# EAGLE design CC3200 (EAGLE 9.6.2)
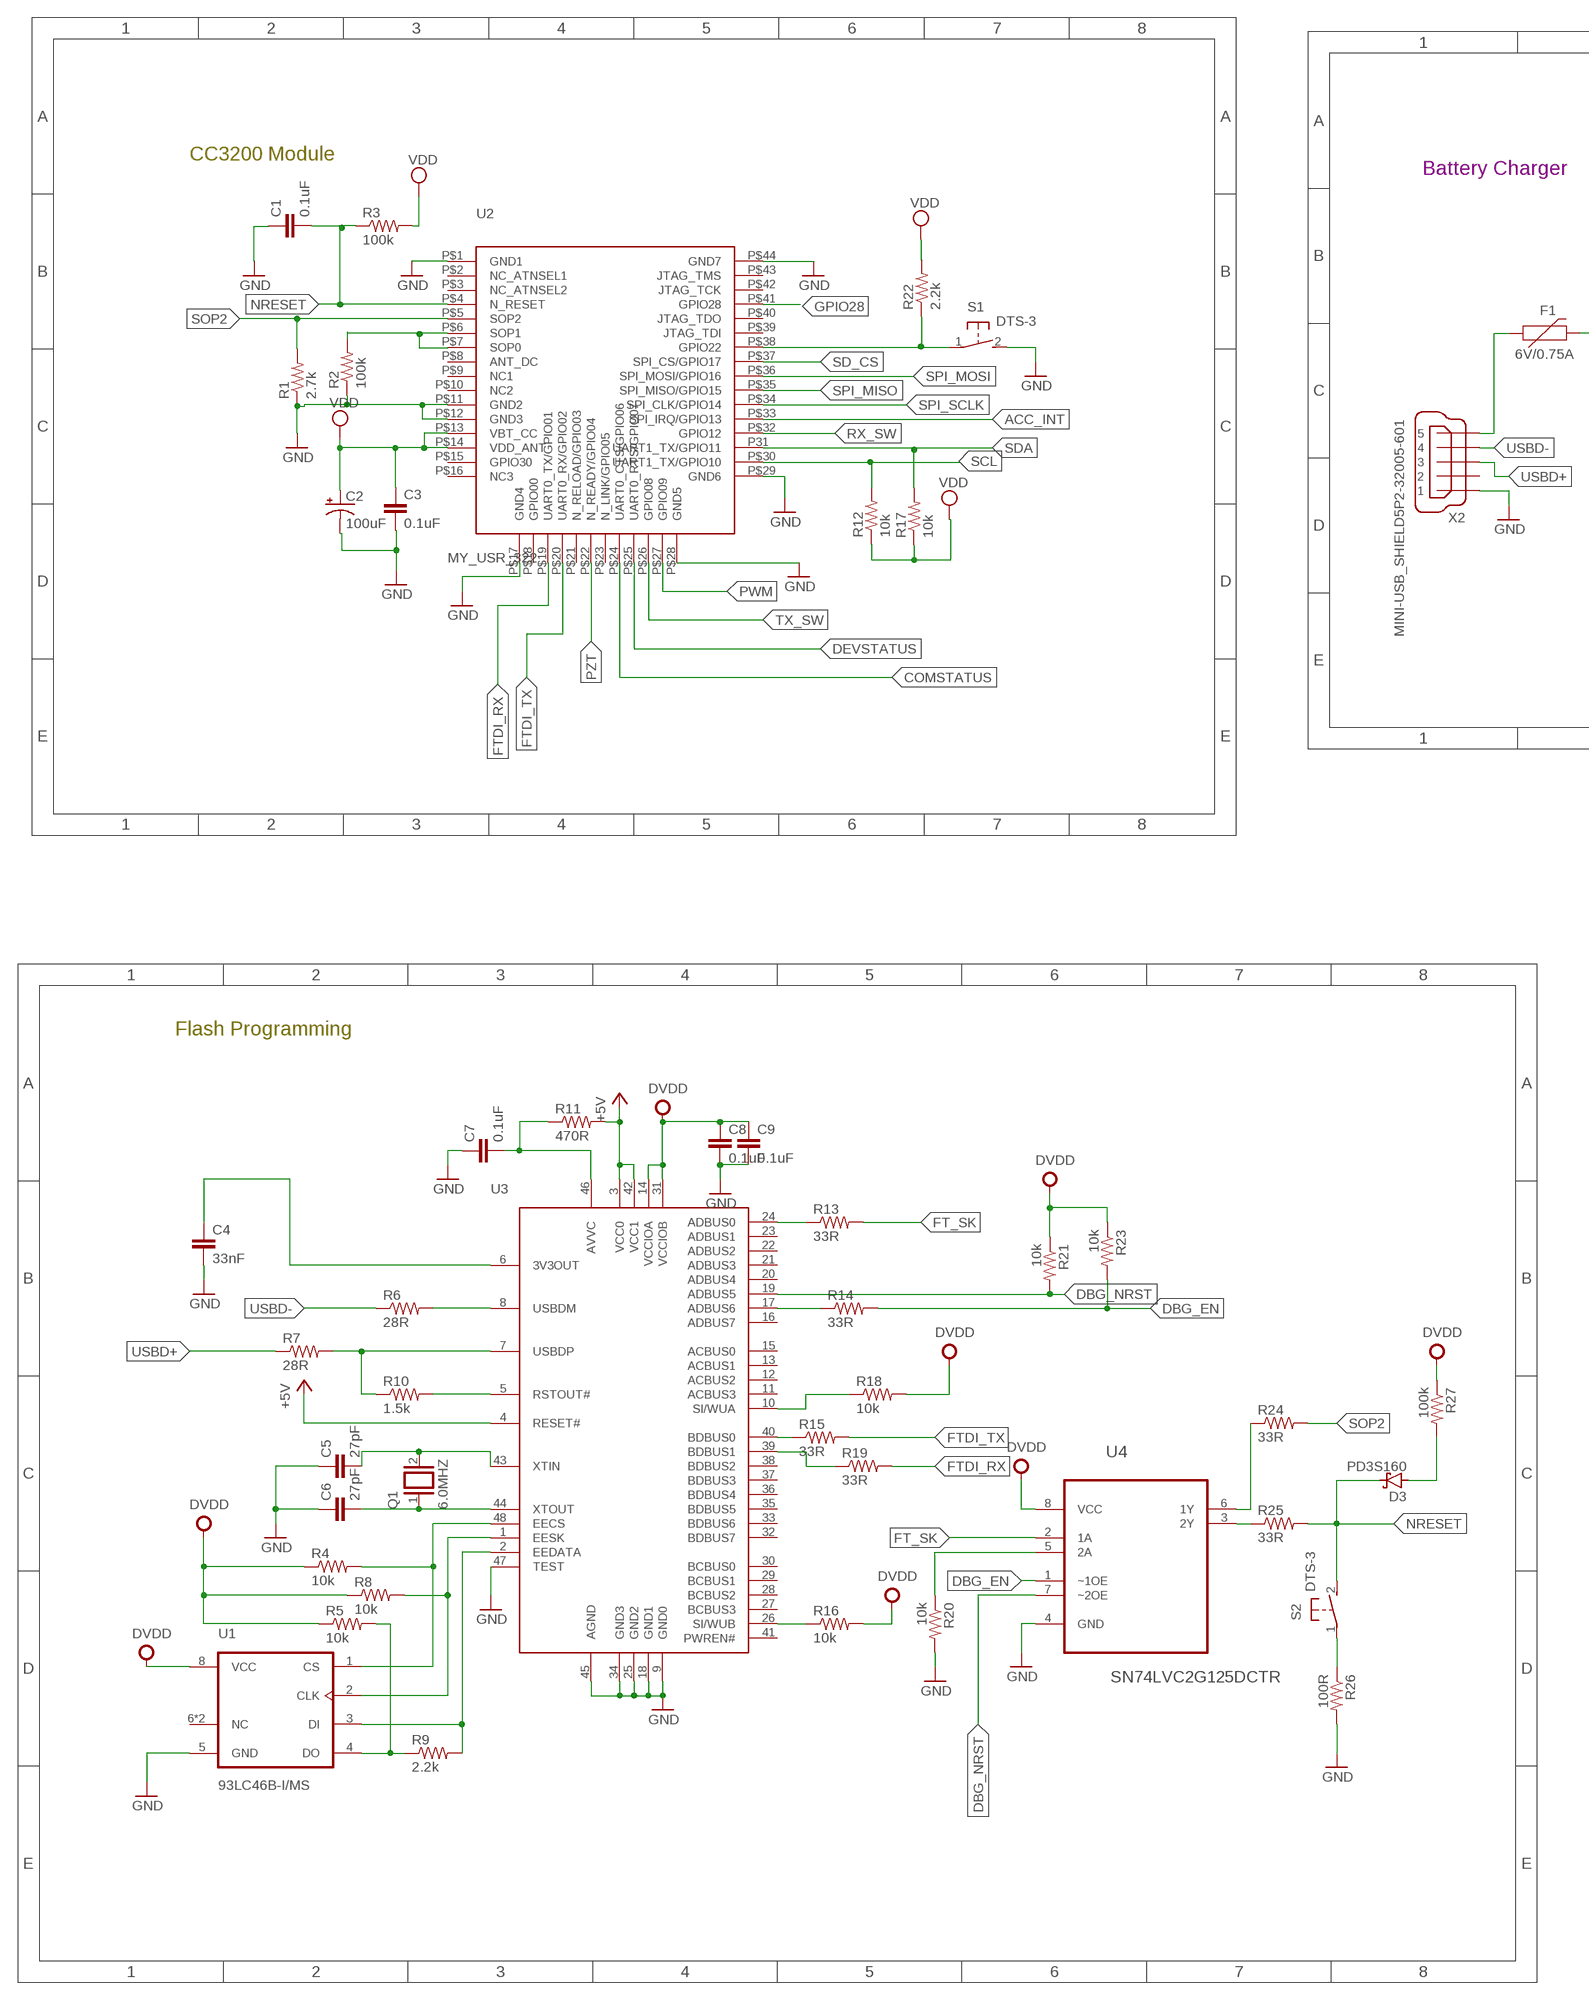
[diagram p0: schematic, sheet 1, part 1 of 2]
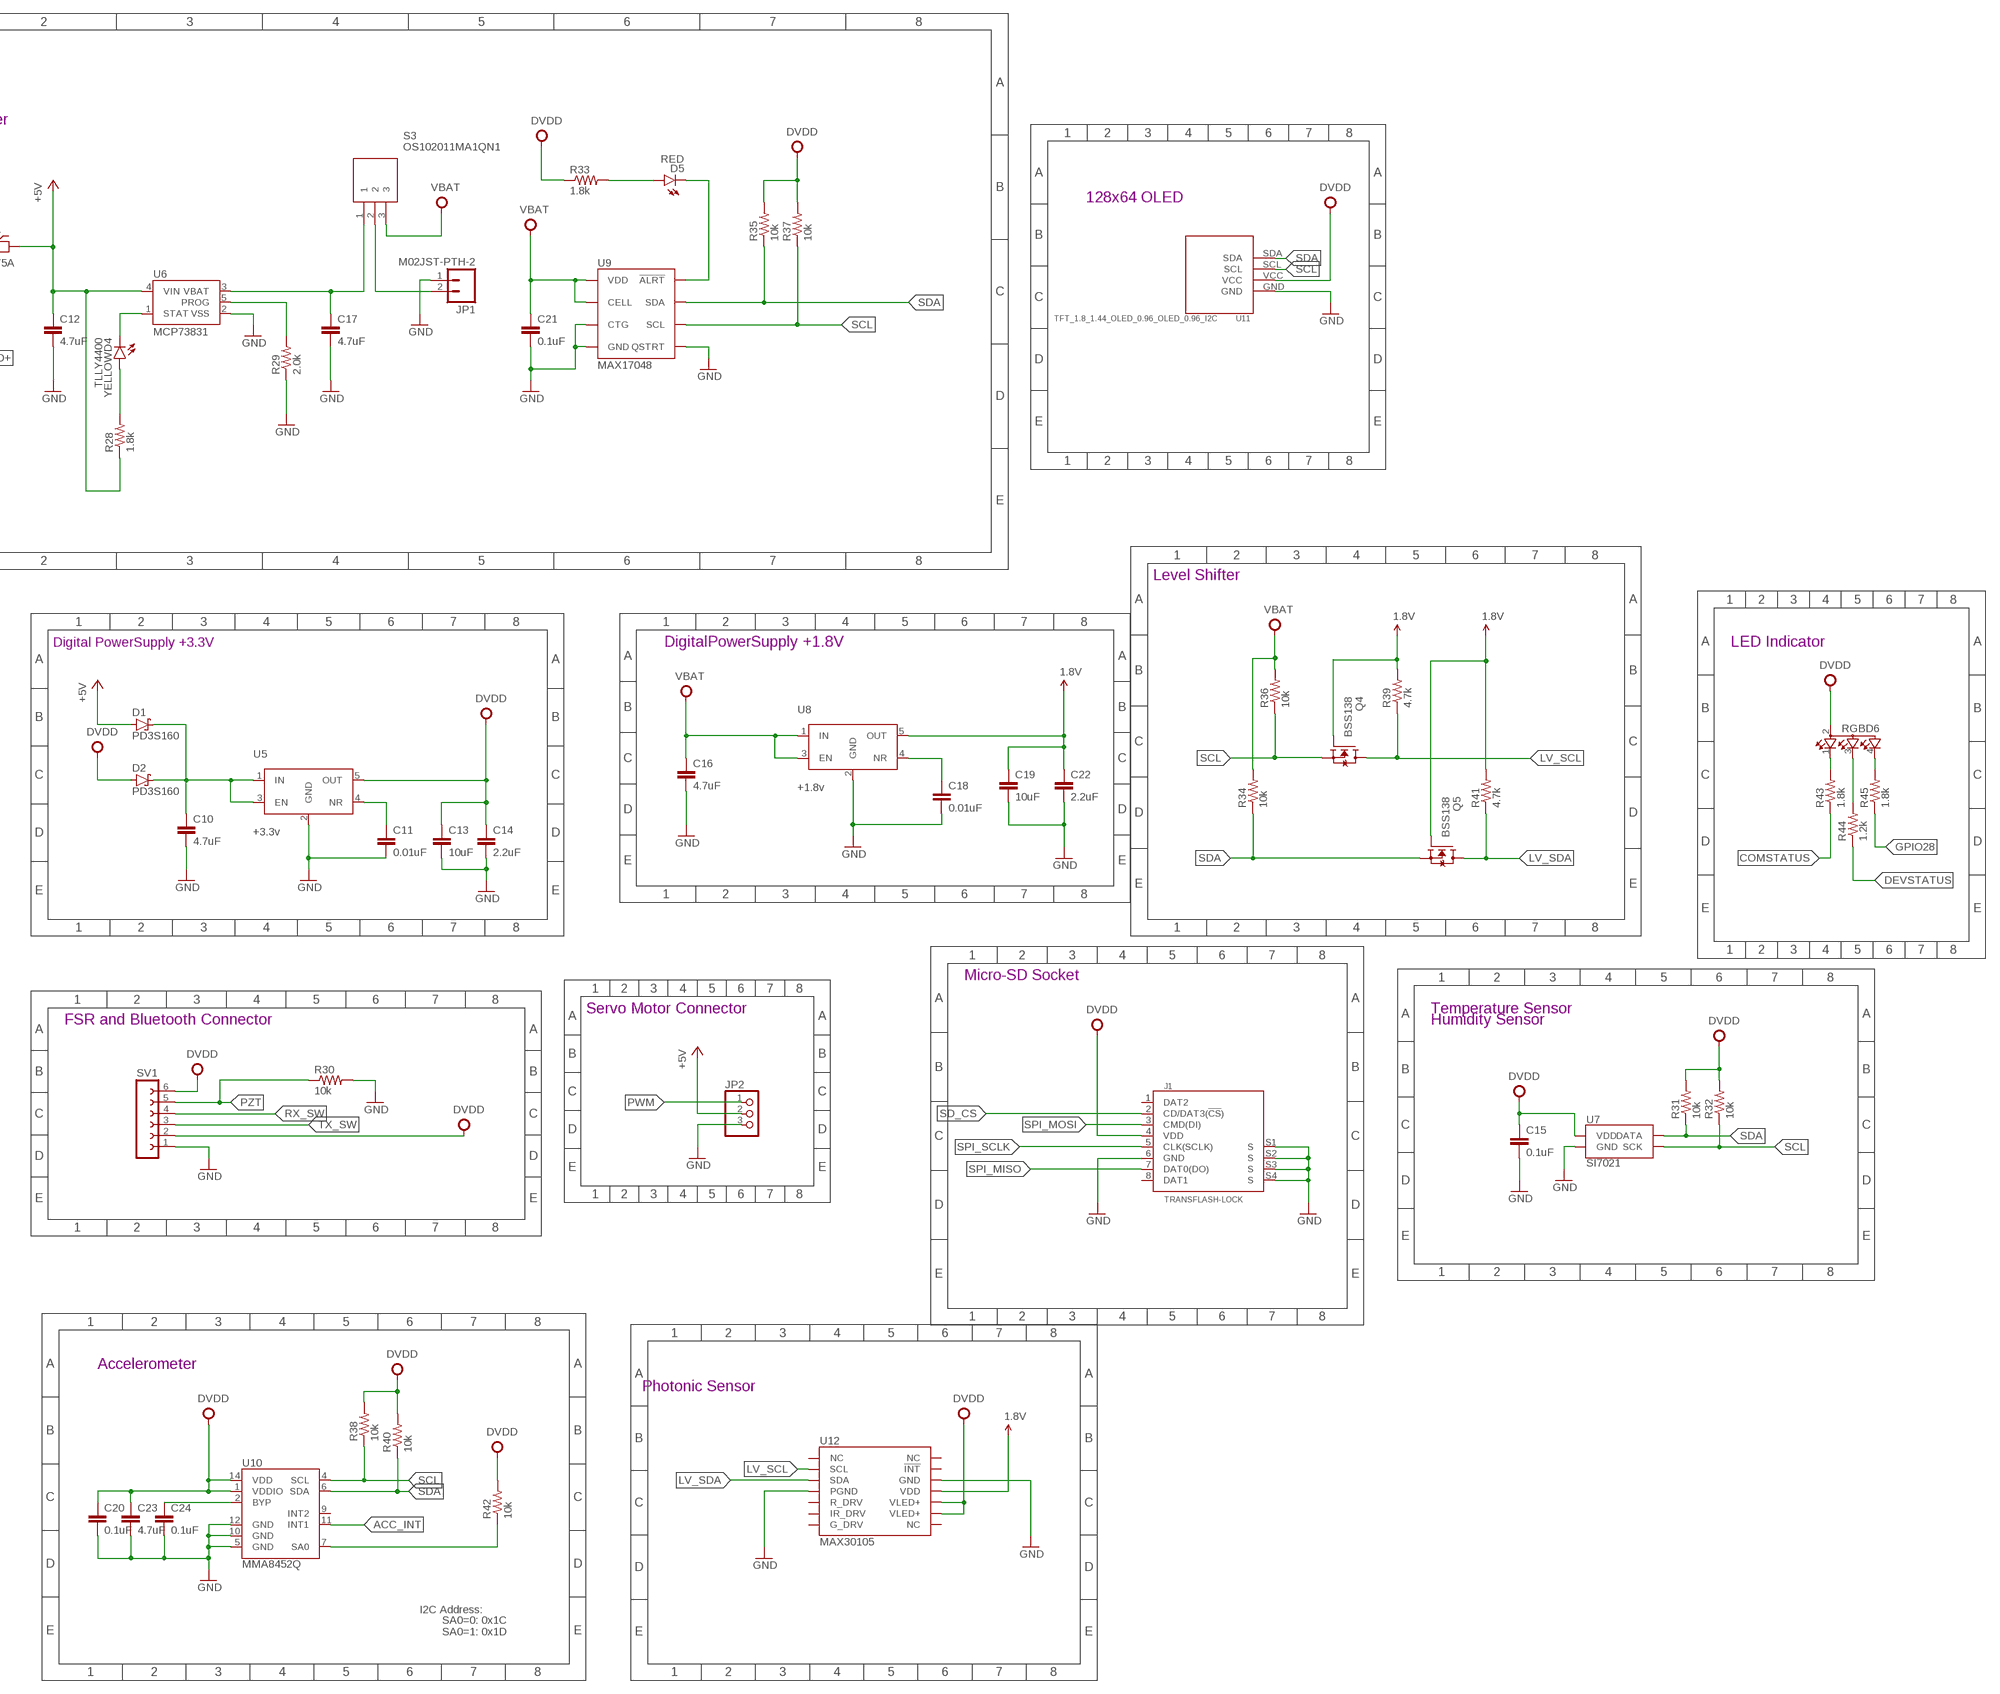
[diagram p1: schematic, sheet 1, part 2 of 2]

## Parts
C1  0.1uF  0.1UF-0402T-6.3V-10%-X7R  [0402-TIGHT]
C2  100uF  100UF-POLAR-1206-6.3V-20%(TANT)  [1206-POLAR]
C3  0.1uF  0.1UF-0402T-6.3V-10%-X7R  [0402-TIGHT]
C4  33nF  CAP0603-CAP  [0603-CAP]
C5  27pF  CAP0603-CAP  [0603-CAP]
C6  27pF  CAP0603-CAP  [0603-CAP]
C7  0.1uF  CAP0603-CAP  [0603-CAP]
C8  0.1uF  CAP0603-CAP  [0603-CAP]
C9  0.1uF  CAP0603-CAP  [0603-CAP]
C10  4.7uF  CAP0603-CAP  [0603-CAP]
C11  0.01uF  CAP0603-CAP  [0603-CAP]
C12  4.7uF  CAP0603-CAP  [0603-CAP]
C13  10uF  CAP0603-CAP  [0603-CAP]
C14  2.2uF  CAP0603-CAP  [0603-CAP]
C15  0.1uF  CAP0603-CAP  [0603-CAP]
C16  4.7uF  CAP0603-CAP  [0603-CAP]
C17  4.7uF  CAP0603-CAP  [0603-CAP]
C18  0.01uF  CAP0603-CAP  [0603-CAP]
C19  10uF  CAP0603-CAP  [0603-CAP]
C20  0.1uF  CAP0603-CAP  [0603-CAP]
C21  0.1uF  CAP0603-CAP  [0603-CAP]
C22  2.2uF  CAP0603-CAP  [0603-CAP]
C23  4.7uF  CAP0603-CAP  [0603-CAP]
C24  0.1uF  CAP0603-CAP  [0603-CAP]
D1  PD3S160  [POWERDI323]
D2  PD3S160  [POWERDI323]
D3  PD3S160  [POWERDI323]
D5  RED  LED-RED0603  [LED-0603]
F1  6V/0.75A  PPTC_THREE-QUARTER-AMP  [1206]
J1  TRANSFLASH-LOCK  [TRANSFLASH-LOCK-SOCK]
JP1  M02JST-PTH-2  [JST-2-PTH]
JP2  PINHD-1X3  [1X03]
Q1  6.0MHZ  XTAL  [Q]
Q4  BSS138  [SOT23]
Q5  BSS138  [SOT23]
R1  2.7k  RESISTOR0603  [0603-RES]
R2  100k  RESISTOR0603  [0603-RES]
R3  100k  RESISTOR0603  [0603-RES]
R4  10k  RESISTOR0603-RES  [0603-RES]
R5  10k  RESISTOR0603-RES  [0603-RES]
R6  28R  RESISTOR0603-RES  [0603-RES]
R7  28R  RESISTOR0603-RES  [0603-RES]
R8  10k  RESISTOR0603-RES  [0603-RES]
R9  2.2k  RESISTOR0603-RES  [0603-RES]
R10  1.5k  RESISTOR0603-RES  [0603-RES]
R11  470R  RESISTOR0603-RES  [0603-RES]
R12  10k  RESISTOR0603  [0603-RES]
R13  33R  RESISTOR0603  [0603-RES]
R14  33R  RESISTOR0603  [0603-RES]
R15  33R  RESISTOR0603  [0603-RES]
R16  10k  RESISTOR0603  [0603-RES]
R17  10k  RESISTOR0603  [0603-RES]
R18  10k  RESISTOR0603  [0603-RES]
R19  33R  RESISTOR0603  [0603-RES]
R20  10k  RESISTOR0603  [0603-RES]
R21  10k  RESISTOR0603  [0603-RES]
R22  2.2k  RESISTOR0603  [0603-RES]
R23  10k  RESISTOR0603  [0603-RES]
R24  33R  RESISTOR0603  [0603-RES]
R25  33R  RESISTOR0603  [0603-RES]
R26  100R  RESISTOR0603  [0603-RES]
R27  100k  RESISTOR0603  [0603-RES]
R28  1.8k  RESISTOR0603  [0603-RES]
R29  2.0k  RESISTOR0603  [0603-RES]
R30  10k  RESISTOR0603  [0603-RES]
R31  10k  RESISTOR0603  [0603-RES]
R32  10k  RESISTOR0603  [0603-RES]
R33  1.8k  RESISTOR0603  [0603-RES]
R34  10k  RESISTOR0603  [0603-RES]
R35  10k  RESISTOR0603  [0603-RES]
R36  10k  RESISTOR0603  [0603-RES]
R37  10k  RESISTOR0603  [0603-RES]
R38  10k  RESISTOR0603  [0603-RES]
R39  4.7k  RESISTOR0603  [0603-RES]
R40  10k  RESISTOR0603  [0603-RES]
R41  4.7k  RESISTOR0603  [0603-RES]
R42  10k  RESISTOR0603  [0603-RES]
R43  1.8k  RESISTOR0603  [0603-RES]
R44  1.2k  RESISTOR0603  [0603-RES]
R45  1.8k  RESISTOR0603  [0603-RES]
RGBD6  TOPLED-3  [P-LCC-4-3]
S1  DTS-3  [DTS-3]
S2  DTS-3  [DTS-3]
S3  OS102011MA1QN1  [OS102011MA1QN1]
SV1  FE06-1  [FE06]
U1  93LC46B-I/MS  [SOP65P490X110-8N]
U2  MY_USR_322  [MY_USR_322]
U3  FT2232D  [LQFP48]
U4  SN74LVC2G125DCTR  [SOP65P400X130-8N]
U5  +3.3v  TPS73233  [SOT23-5]
U6  MCP73831  [SOT23-5]
U7  SI7021  [DFN-6-3X3-SI7021]
U8  +1.8v  TPS73218  [SOT23-5]
U9  MAX17048  MAX17048DFN8  [DFN-8]
U10  MMA8452Q  [QFN-16_0.5MM]
U11  TFT_1.8_1.44_OLED_0.96_OLED_0.96_I2C  [TFT_1.8_1.44_OLED_0.96_OLED_0.96_I2C]
U12  MAX30105  MAX30105SMD  [OLGA-14]
X2  MINI-USB_SHIELD5P2-32005-601  [32005-601]
YELLOWD4  TLLY4400  [LED3MM]

## Nets
1.8V: C19.1 C22.1 Q5.1(G) R39.2 R41.2 U8.5(OUT) U12.11(VDD)
+5V: C12.1 D1.A F1.2 JP2.2 R11.2 R28.1 U3.3(VCC0) U3.4(RESET#) U3.42(VCC1) U6.4(VIN)
ACC_INT: U2.P$33(SPI_IRQ/GPIO13) U10.11(INT1)
COMSTATUS: R43.1 U2.P$24(UART0_CTS/GPIO06)
DBG_EN: R14.2 R23.2 U4.1(~1OE)
DBG_NRST: R21.2 U3.19(ADBUS5) U4.7(~2OE)
DEVSTATUS: R44.1 U2.P$25(UART0_RTS/GPIO07)
DVDD: C8.1 C9.1 C13.1 C14.1 C15.1 C20.1 C23.1 D2.A J1.4(VDD) R4.1 R5.1 R8.1 R16.2 R18.2 R21.1 R23.1 R27.1 R31.2 R32.2 R33.1 R35.2 R37.2 R38.2 R40.2 R42.2 RGBD6.2(A2) SV1.2 SV1.6 U1.8(VCC) U3.14(VCCIOA) U3.31(VCCIOB) U4.8(VCC) U5.5(OUT) U7.VDD U10.1(VDDIO) U10.14(VDD) U11.VCC U12.9(VLED+) U12.10(VLED+)
FT_SK: R13.2 U4.2(1A)
FTDI_RX: R19.2 U2.P$19(UART0_TX/GPIO01)
FTDI_TX: R15.2 U2.P$20(UART0_RX/GPIO02)
GND: C1.1 C3.2 C4.2 C5.1 C6.1 C7.1 C8.2 C9.2 C10.2 C11.2 C12.2 C13.2 C14.2 C15.2 C16.2 C17.2 C18.2 C19.2 C20.2 C21.2 C22.2 C23.2 C24.2 J1.6(GND) J1.S1(S) J1.S2(S) J1.S3(S) J1.S4(S) JP1.1 JP2.3 R1.1 R20.2 R26.2 R29.1 R30.2 S1.2 SV1.1 U1.5(GND) U2.P$1(GND1) U2.P$11(GND2) U2.P$17(GND4) U2.P$28(GND5) U2.P$29(GND6) U2.P$44(GND7) U3.9(GND0) U3.18(GND1) U3.25(GND2) U3.34(GND3) U3.45(AGND) U3.47(TEST) U4.4(GND) U5.2(GND) U6.2(VSS) U7.GND U8.2(GND) U9.P$1(CTG) U9.P$4(GND) U9.P$6(QSTRT) U9.P$9(GND) U10.5(GND) U10.10(GND) U10.12(GND) U11.GND U12.4(PGND) U12.12(GND) X2.1
GPIO28: R45.1 U2.P$41(GPIO28)
LV_SCL: R39.1 U12.2(SCL)
LV_SDA: Q5.3(D) R41.1 U12.3(SDA)
N$1: C3.1
N$2: S1.1 U2.P$38(GPIO22)
N$3: R2.2 U2.P$6(SOP1)
N$4: U2.P$7(SOP0)
N$5: R3.1
N$6: R2.1
N$7: R22.1
N$8: C1.2
N$9: R12.2
N$10: R17.2
N$11: U2.P$13(VBT_CC)
N$12: Q4.1(G)
N$13: Q4.3(D)
N$14: C2.2(-)
N$15: U2.P$12(GND3)
N$16: Q4.2(S)
N$17: Q5.2(S)
N$29: C4.1 U3.6(3V3OUT)
N$37: R6.2 U3.8(USBDM)
N$40: R7.2 R10.1 U3.7(USBDP)
N$41: R10.2 U3.5(RSTOUT#)
N$42: C5.2 Q1.2 U3.43(XTIN)
N$44: C6.2 Q1.1 U3.44(XTOUT)
N$45: R9.2 U1.3(DI) U3.2(EEDATA)
N$48: R5.2 R9.1 U1.4(DO)
N$49: R8.2 U1.2(CLK) U3.1(EESK)
N$50: R4.2 U1.1(CS) U3.48(EECS)
N$51: C7.2 R11.1 U3.46(AVVC)
N$52: R13.1 U3.24(ADBUS0)
N$53: R14.1 U3.17(ADBUS6)
N$54: R18.1 U3.10(SI/WUA)
N$55: R15.1 U3.40(BDBUS0)
N$56: R19.1 U3.39(BDBUS1)
N$57: R16.1 U3.26(SI/WUB)
N$58: R20.1 U4.5(2A)
N$59: R25.1 U4.3(2Y)
N$60: D3.A R27.2
N$61: R24.1 U4.6(1Y)
N$62: R26.1 S2.1
N$63: D5.C U9.P$5(!ALRT)
N$64: D5.A R33.2
N$65: JP1.2 S3.2
N$66: R29.2 U6.5(PROG)
N$67: C17.1 S3.1 U6.3(VBAT)
N$68: U6.1(STAT) YELLOWD4.K(C)
N$69: R28.2 YELLOWD4.A
N$70: F1.1 X2.5
N$71: C10.1 D1.C D2.C U5.1(IN) U5.3(EN)
N$72: C11.1 U5.4(NR)
N$73: C18.1 U8.4(NR)
N$74: R43.2 RGBD6.1(CRED)
N$75: R44.2 RGBD6.3(CBLUE)
N$76: R45.2 RGBD6.4(CGREEN)
N$77: C24.1 U10.2(BYP)
N$78: R42.1 U10.7(SA0)
NRESET: D3.C R25.2 S2.2 U2.P$4(N_RESET)
PWM: JP2.1 U2.P$27(GPIO09)
PZT: R30.1 SV1.5 U2.P$22(N_READY/GPIO04)
RX_SW: SV1.4 U2.P$32(GPIO12)
SCL: R32.1 R36.1 R37.1 R38.1 U2.P$30(UART1_TX/GPIO10) U7.SCK U9.P$7(SCL) U10.4(SCL) U11.SCL
SD_CS: J1.2(CD/DAT3(!CS!)) U2.P$37(SPI_CS/GPIO17)
SDA: R31.1 R34.1 R35.1 R40.1 U2.P31(UART1_TX/GPIO11) U7.DATA U9.P$8(SDA) U10.6(SDA) U11.SDA
SOP2: R1.2 R24.2 U2.P$5(SOP2)
SPI_MISO: J1.7(DAT0(DO)) U2.P$35(SPI_MISO/GPIO15)
SPI_MOSI: J1.3(CMD(DI)) U2.P$36(SPI_MOSI/GPIO16)
SPI_SCLK: J1.5(CLK(SCLK)) U2.P$34(SPI_CLK/GPIO14)
TX_SW: SV1.3 U2.P$26(GPIO08)
USBD+: R7.1 X2.3
USBD-: R6.1 X2.4
VBAT: C16.1 C21.1 R34.2 R36.2 S3.3 U8.1(IN) U8.3(EN) U9.P$2(CELL) U9.P$3(VDD)
VDD: C2.1(+) R3.2 R12.1 R17.1 R22.2 U2.P$14(VDD_ANT)
Unconnected: J1.1(DAT2) J1.8(DAT1) U1.6(NC) U1.7(NC) U2.P$2(NC_ATNSEL1) U2.P$3(NC_ATNSEL2) U2.P$8(ANT_DC) U2.P$9(NC1) U2.P$10(NC2) U2.P$15(GPIO30) U2.P$16(NC3) U2.P$18(GPIO00) U2.P$21(N_RELOAD/GPIO03) U2.P$23(N_LINK/GPIO05) U2.P$39(JTAG_TDI) U2.P$40(JTAG_TDO) U2.P$42(JTAG_TCK) U2.P$43(JTAG_TMS) U3.11(ACBUS3) U3.12(ACBUS2) U3.13(ACBUS1) U3.15(ACBUS0) U3.16(ADBUS7) U3.20(ADBUS4) U3.21(ADBUS3) U3.22(ADBUS2) U3.23(ADBUS1) U3.27(BCBUS3) U3.28(BCBUS2) U3.29(BCBUS1) U3.30(BCBUS0) U3.32(BDBUS7) U3.33(BDBUS6) U3.35(BDBUS5) U3.36(BDBUS4) U3.37(BDBUS3) U3.38(BDBUS2) U3.41(PWREN#) U10.9(INT2) U12.1(NC) U12.5(R_DRV) U12.6(IR_DRV) U12.7(G_DRV) U12.8(NC) U12.13(!INT) U12.14(NC) X2.2 X2.M1(S1) X2.M2(S2)

## Notes on the sheet
- CC3200 Module
- Battery Charger
- 128x64 OLED
- Level Shifter
- Digital PowerSupply +3.3V | DigitalPowerSupply +1.8V | LED Indicator
- Flash Programming
- Micro-SD Socket
- Servo Motor Connector | Temperature Sensor
- FSR and Bluetooth Connector | Humidity Sensor
- Accelerometer
- Photonic Sensor
- I2C Address:
- SA0=0: 0x1C
  SA0=1: 0x1D

## Library data of the parts
C1 C3 = SparkFun-Capacitors:0.1UF: 0.1µF ceramic capacitors A capacitor is a passive two-terminal electrical component used to store electrical energy temporarily in an electric field.; PROD_ID: CAP-14993
C2 = SparkFun-Capacitors:100UF-POLAR: 100µF polarized capacitors A capacitor is a passive two-terminal electrical component used to store electrical energy temporarily in an electric field.; PROD_ID: CAP-14093
C4-C24 = SparkFun:CAP: Capacitor Standard 0603 ceramic capacitor, and 0.1" leaded capacitor.
D1-D3 = diode:PD3S160: 1.0A SURFACE MOUNT SCHOTTKY BARRIER RECTIFIER POWERDI ® 323 Source: http://www.diodes.com/datasheets/ds30899.pdf
D5 = SparkFun-LED:LED-RED: Assorted Red LEDs LilyPad 1206- DIO-09912 1206- DIO-00809 0603- DIO-00819; PROD_ID: DIO-09912
F1 = SparkFun-Fuses:PPTC: Resettable Fuse PPTC Resettable Fuse. Really a sort of resistor with a polymeric positive temperature coefficient whose resistance increases dramatically with an increase in temperature. When heated by the power passing through the resistance rises causing the current to be limited, protecting the circuit. This is achieved by the transition of the polymer from a crystalline to an amorphous state where the conductive carbon separates breaking the conductive pathways found in the cool crystalline structure. When a PPTC cools back down it resumes conducting letting the circuit turn back on. SparkFun Products: SparkFun RedBoard - Programmed with Arduino <https://www.sparkfun.com/products/12757> Pro Micro - 5V/16MHz <https://www.sparkfun.com/products/12640> Arduino Pro 328 - 5V/16MHz <https://www.sparkfun.com/products/10915> MP3 Trigger <https://www.sparkfun.com/products/13720>; PROD_ID: RES-11150
J1 = MicroSDCardSocket_1:TRANSFLASH: TransFlash TF Micro SD Card Socket Adapter
JP1 = M02_JST-2-PTH:M02: Standard 2-pin 0.1" header. Use with - straight break away headers ( PRT-00116) - right angle break away headers (PRT-00553) - swiss pins (PRT-00743) - machine pins (PRT-00117) - female headers (PRT-00115) Molex polarized connector foot print use with: PRT-08233 with associated crimp pins and housings. 2.54_SCREWTERM for use with PRT-10571. 3.5mm Screw Terminal footprints for PRT-08084 5mm Screw Terminal footprints for use with PRT-08432; PROD_ID: CONN-09863; SKU: PRT-09914; STOREFRONT_ID: PRT-08432
JP2 = pinhead:PINHD-1X3: PIN HEADER
Q1 = special:XTAL: CRYSTAL
Q4 Q5 = bss138_10:BSS138: BSS138 N-Channel Logic Level Enhancement Mode Field Effect Transistor Source: http://www.fairchildsemi.com/datasheets/BS/BSS138.pdf; MF: Fairchild; MPN: BSS138; OC_FARNELL: 9845330; OC_NEWARK: 67R2009
R1-R45 = SparkFun-Resistors:RESISTOR: Resistor Basic schematic elements and footprints for 0603, 1206, and PTH resistors.
RGBD6 = led:TOPLED-3: OSRAM - Hyper Multi TOPLED® (RGB) LB E673, LV E673, LT E673 - Power TOPLED® Enhanced optical Power LED (HOP2000) LS E67B, LA E67B, LO E67B, LY E67B - Hyper Multi TOPLED® Enhanced optical Power LED (HOP2000 / ATON®) LATB T66B - Hyper Multi TOPLED® Hyper-Bright LED LATB T686 Source: http://www.osram.convergy.de/
S1 = switch-tact:DTS-3
S2 = switch-tact_MOD:DTS-3
S3 = OS102011MA1QN1:OS102011MA1QN1: Switch Slide Right Angle SPDT 0.1A 12VDC Through Hole Slide Switch SPDT On-On 0.1 A@ 12 V dc Slide Source: Datasheet <http://www.ckswitches.com/media/1428/os.pdf>; ALLIED_NUMBER: 70128246; ALLIED_PRICE-STOCK: https://www.alliedelec.com/c-k-os102011ma1qn1/70128246/; DESCRIPTION: Switch Slide Right Angle SPDT 0.1A 12VDC Through Hole Slide Switch SPDT On-On 0.1 A@ 12 V dc Slide; HEIGHT: mm; MANUFACTURER_NAME: C & K COMPONENTS; MANUFACTURER_PART_NUMBER: OS102011MA1QN1; MOUSER_PART_NUMBER: 611-OS102011MA1QN1; MOUSER_PRICE-STOCK: https://www.mouser.com/Search/Refine.aspx?Keyword=611-OS102011MA1QN1; RS_PART_NUMBER: 7874855; RS_PRICE-STOCK: http://uk.rs-online.com/web/p/products/7874855
SV1 = con-lsta:FE06-1: FEMALE HEADER; OC_FARNELL: unknown; OC_NEWARK: unknown
U1 = 93LC46B-I_MS:93LC46B-I/MS; AVAILABILITY: Unavailable; DESCRIPTION: EEPROM Memory IC 1Kb _64 x 16_ SPI 2MHz 8-MSOP; MF: Microchip; MP: 93LC46B-I/MS; PACKAGE: MSOP-8 Microchip; PRICE: None
U2 = MY_USR_322:MY_USR_322
U3 = ftdichip:FT2232D: USB UART / FIFO Controller 3nd Generation USB Double-UART (USB <-> Serial) - FIFO Controller
U4 = SN74LVC2G125DCTR:SN74LVC2G125DCTR: Dual Bus Buffer; DESCRIPTION: Buffer/Line Driver 2-CH Non-Inverting 3-ST CMOS 8-Pin SSOP T/R; DIGI-KEY_PART_NUMBER: 296-12164-1-ND; DIGI-KEY_PURCHASE_URL: https://www.digikey.com/product-detail/en/texas-instruments/SN74LVC2G125DCTR/296-12164-1-ND/412007?utm_source=snapeda&utm_medium=aggregator&utm_campaign=symbol; MF: Texas Instruments; MP: SN74LVC2G125DCTR; PACKAGE: LSSOP-8 Texas Instruments
U5 U8 = TPS732-:TPS732*
U6 = SparkFun-PowerIC:MCP73831: Miniature single cell, fully integrated Li-Ion, Li-polymer charge management controller http://ww1.microchip.com/downloads/en/DeviceDoc/21984a.pdf IC-09995; PROD_ID: IC-09995
U7 = SparkFun-Sensors:SI7021: Silicon Labs Si7021 I2C Humidity and Temperature Sensor The Si7021 is a low-cost, easy-to-use, highly accurate, digital humidity and temperature sensor. This sensor is ideal for environmental sensing and data logging and perfect for build a weather stations or humidor control system. All you need are two lines for I2C communication, and you’ll have relative humidity readings and very accurate temperature readings as a bonus! Datasheet <https://cdn.sparkfun.com/datasheets/Sensors/Weather/Si7021.pdf> SparkFun Products SparkFun Humidity and Temperature Sensor Breakout - Si7021 <https://www.sparkfun.com/products/13763> (SEN-13763) SparkFun Blynk Board - ESP8266 <https://www.sparkfun.com/products/13794> (WRL-13794); PROD_ID: IC-13093
U9 = SparkFun-IC-Power:MAX17048: Micropower 1-Cell Li+ ModelGauge SparkFun Products Qduino Mini <https://www.sparkfun.com/products/13614> (DEV-13614); PROD_ID: IC-12551
U10 = SparkFun:MMA8452Q: MMA8452Q 3-Axis, 12/8-bit Digital Accelerometer Supply Voltage: 1.6-3.6V Range: +/- 2g, 4g, 8g Interface: I2C, 12-bit and 8-bit ODR: 1.56 Hz - 800 Hz Package: QFN-16 http://cache.freescale.com/files/sensors/doc/data_sheet/MMA8452Q.pdf
U11 = OLED_96_I2C_V1:TFT_1.8_1.44_OLED_0.96_OLED_0.96_I2C
U12 = SparkFun-Sensors:MAX30105: MAX30105 High Sensitivity Optical Sensor Can be used for Pulse Detection, Pulse Ox, and possible visual particle detection. I2C communication. Datasheet <https://datasheets.maximintegrated.com/en/ds/MAX30105.pdf> SparkFun Products: SparkFun Particle Sensor Breakout - MAX30105 <https://www.sparkfun.com/products/14045>; PROD_ID: IC-13510
X2 = con-cypressindustries:MINI-USB_SHIELD5P2-: MINI USB-B R/A DIP 5pol. Source: www.cypressindustries.com; OC_FARNELL: unknown; OC_NEWARK: unknown
YELLOWD4 = led:TLLY4400: Low Current (2mA) LED 3 mm Tinted Diffused Package color YELLOW Source: Data sheet <http://www.farnell.com/datasheets/391098.pdf>; MF: VISHAY SEMICONDUCTOR; OC_FARNELL: 1612439

## Board
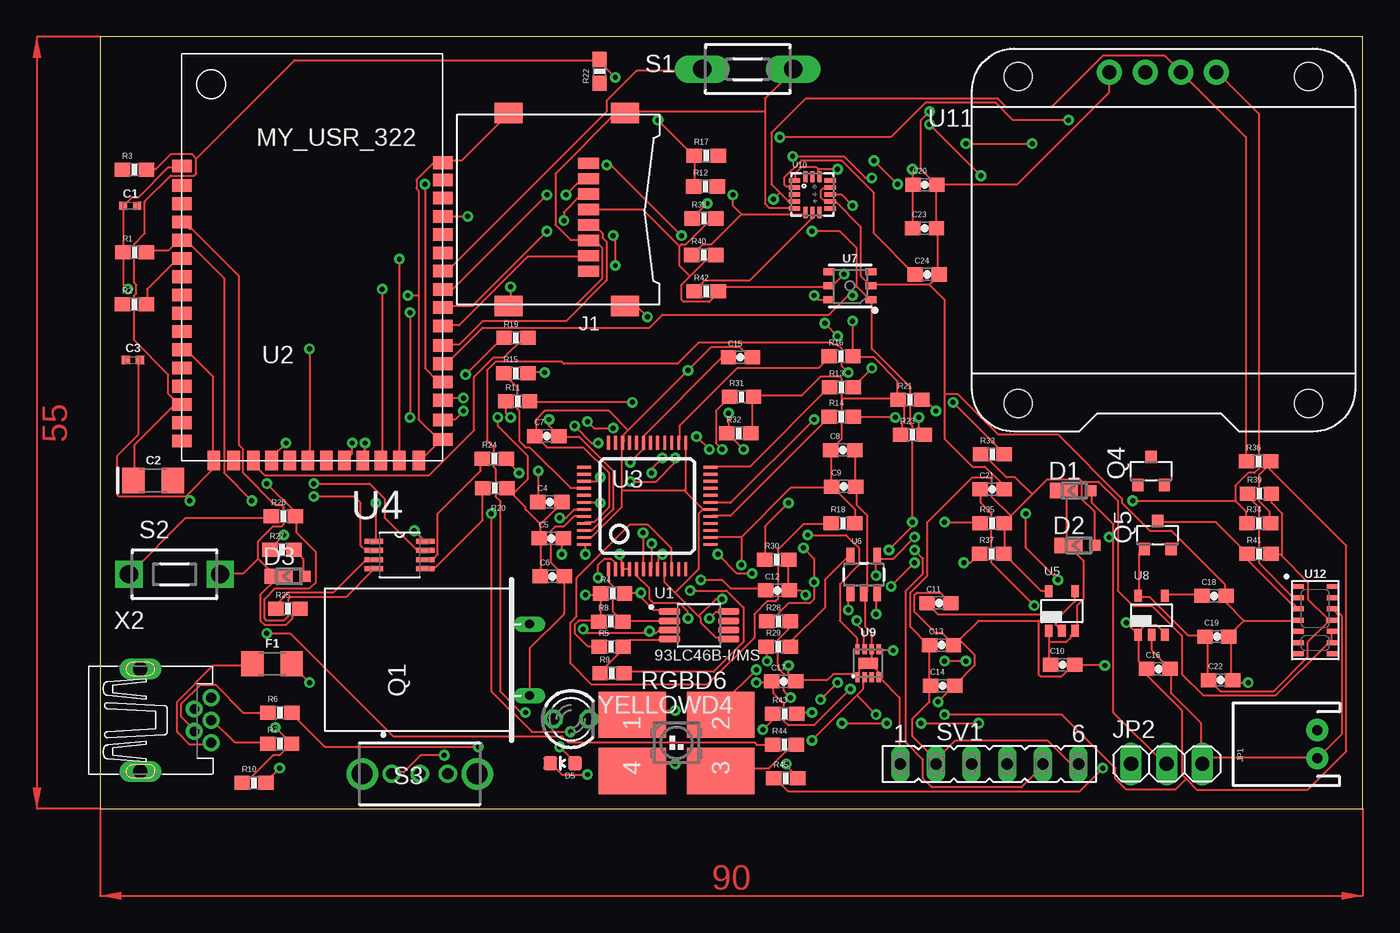
[diagram p2: board, top side]
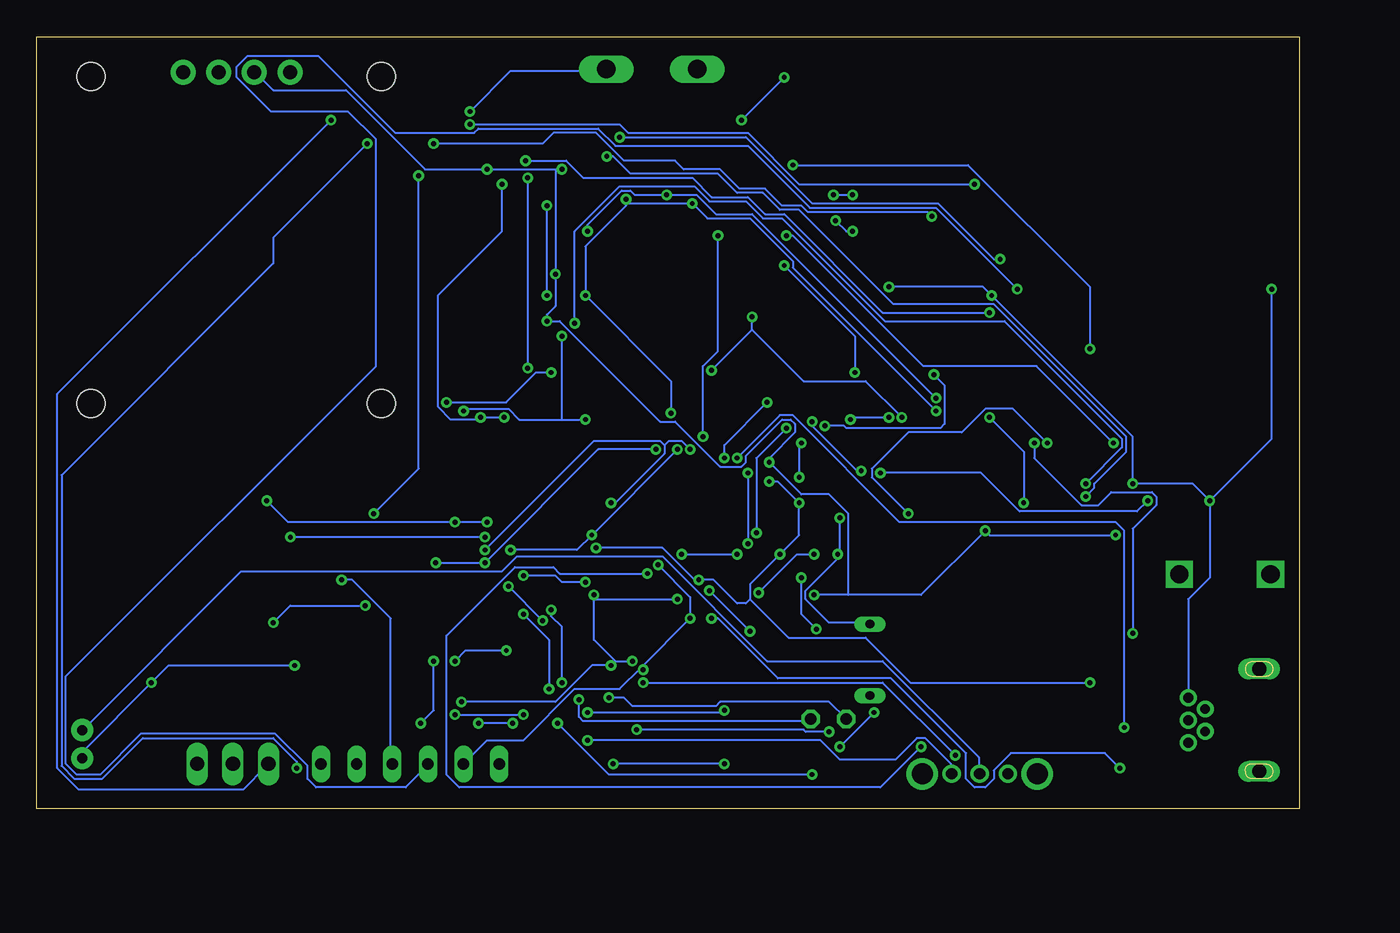
[diagram p3: board, bottom side, seen from below]

Size 90 x 55 mm. Coordinates in mm from the lower left corner, seen from the top.
Outline: 0,0 90,0 90,55 0,55 0,0
Copper layers (1*16): Top 0.035mm / dielectric 1.5mm / Bottom 0.035mm
Design rules "default": minimum track width 6mil, minimum drill 0.35mm, track to track 6mil, track to pad 6mil, pad to pad 6mil, via to via 6mil, smd to smd 6mil, copper to edge 40mil, drill to drill 6mil, minimum pad ring 10mil, minimum via ring 8mil, stop-mask expansion 4mil, vias tented up to drill 0mil, thermal gap 10mil

### Footprints (pad centres in the part's own frame; a part is rotated, then mirrored left to right if it is on the bottom)
0402-TIGHT = smd 0.6 x 0.6: 1 -0.5,0; 2 0.5,0
1206-POLAR = smd 1.6 x 1.8: 1 -1.4,0; 2 1.4,0
0603-CAP = smd 1.1 x 1: 1 -0.85,0; 2 0.85,0
POWERDI323 = smd 0.8 x 0.8: A 1.15,0 | smd 2 x 1.1: C -0.75,0
LED-0603 = smd 1 x 1: A 0,-0.877; C 0,0.877
1206 = smd 1.6 x 1.8: 1 -1.4,0; 2 1.4,0
TRANSFLASH-LOCK-SOCK = smd 0.8 x 1.5: 1 3.3,-0.46; 2 2.2,-0.46; 3 1.1,-0.46; 4 0,-0.46; 5 -1.1,-0.46; 6 -2.2,-0.46; 7 -3.3,-0.46; 8 -4.4,-0.46 | smd 1.45 x 2: S1 -6.875,-3.06; S2 -6.875,5.24; S3 6.875,5.24; S4 6.875,-3.06
JST-2-PTH = drill 0.7 pad 1.6: 1 -1,0; 2 1,0
1X03 = drill 1.016 long: 1 -2.54,0; 2 0,0; 3 2.54,0
Q = drill 0.61 long: 1 -2.54,-7.62; 2 2.54,-7.62
SOT23 = smd 0.8 x 0.9: 1 -0.95,-1; 2 0.95,-1; 3 0,1
0603-RES = smd 1.1 x 1: 1 -0.85,0; 2 0.85,0
P-LCC-4-3 = smd 3.3 x 4.8: 1 -2,-3.15; 2 -2,3.15; 3 2,3.15; 4 2,-3.15
DTS-3 = drill 1.3 long: 1 -3.25,0; 2 3.25,0
DTS-3' = drill 1.3 square: 1 -3.25,0; 2 3.25,0
OS102011MA1QN1 = drill 0.8 pad 1.3: 1 -2,0; 2 0,0; 3 2,0 | drill 1.5 pad 2.25: 4 -4.1,0; 5 4.1,0
FE06 = drill 0.813 long: 1 -6.35,0; 2 -3.81,0; 3 -1.27,0; 4 1.27,0; 5 3.81,0; 6 6.35,0
SOP65P490X110-8N = smd 1.5 x 0.49: 1 -2.105,0.975; 2 -2.105,0.325; 3 -2.105,-0.325; 4 -2.105,-0.975; 5 2.105,-0.975; 6 2.105,-0.325; 7 2.105,0.325; 8 2.105,0.975
MY_USR_322 = smd 1.4 x 0.9: P31 9.3,-10.2; P$1 -9.3,6.5; P$2 -9.3,5.1; P$3 -9.3,3.8; P$4 -9.3,2.5; P$5 -9.3,1.2; P$6 -9.3,-0.1; P$7 -9.3,-1.4; P$8 -9.3,-2.7; P$9 -9.3,-4; P$10 -9.3,-5.3; P$11 -9.3,-6.6; P$12 -9.3,-7.9; P$13 -9.3,-9.2; P$14 -9.3,-10.5; P$15 -9.3,-11.8; P$16 -9.3,-13.1; P$29 9.3,-13; P$30 9.3,-11.6; P$32 9.3,-8.9; P$33 9.3,-7.6; P$34 9.3,-6.3; P$35 9.3,-4.9; P$36 9.3,-3.6; P$37 9.3,-2.3; P$38 9.3,-1; P$39 9.3,0.3; P$40 9.3,1.6; P$41 9.3,2.9; P$42 9.3,4.2; P$43 9.3,5.5; P$44 9.299,6.72 | smd 0.9 x 1.4: P$17 -7,-14.5; P$18 -5.6,-14.5; P$19 -4.2,-14.5; P$20 -2.9,-14.5; P$21 -1.6,-14.5; P$22 -0.3,-14.5; P$23 1,-14.5; P$24 2.3,-14.5; P$25 3.6,-14.5; P$26 4.9,-14.5; P$27 6.2,-14.5; P$28 7.6,-14.5
LQFP48 = smd 0.2 x 1: 1 -2.75,-4.5; 2 -2.25,-4.5; 3 -1.75,-4.5; 4 -1.25,-4.5; 5 -0.75,-4.5; 6 -0.25,-4.5; 7 0.25,-4.5; 8 0.75,-4.5; 9 1.25,-4.5; 10 1.75,-4.5; 11 2.25,-4.5; 12 2.75,-4.5; 25 2.75,4.5; 26 2.25,4.5; 27 1.75,4.5; 28 1.25,4.5; 29 0.75,4.5; 30 0.25,4.5; 31 -0.25,4.5; 32 -0.75,4.5; 33 -1.25,4.5; 34 -1.75,4.5; 35 -2.25,4.5; 36 -2.75,4.5 | smd 1 x 0.2: 13 4.5,-2.75; 14 4.5,-2.25; 15 4.5,-1.75; 16 4.5,-1.25; 17 4.5,-0.75; 18 4.5,-0.25; 19 4.5,0.25; 20 4.5,0.75; 21 4.5,1.25; 22 4.5,1.75; 23 4.5,2.25; 24 4.5,2.75; 37 -4.5,2.75; 38 -4.5,2.25; 39 -4.5,1.75; 40 -4.5,1.25; 41 -4.5,0.75; 42 -4.5,0.25; 43 -4.5,-0.25; 44 -4.5,-0.75; 45 -4.5,-1.25; 46 -4.5,-1.75; 47 -4.5,-2.25; 48 -4.5,-2.75
SOP65P400X130-8N = smd 1.321 x 0.356: 1 -1.829,0.965; 2 -1.829,0.33; 3 -1.829,-0.33; 4 -1.829,-0.965; 5 1.829,-0.965; 6 1.829,-0.33; 7 1.829,0.33; 8 1.829,0.965
SOT23-5 = smd 0.55 x 0.85: 1 -0.95,-1.4; 2 0,-1.4; 3 0.95,-1.4; 4 0.95,1.4; 5 -0.95,1.4
SOT23-5' = smd 0.55 x 1.2: 1 -0.95,-1.3; 2 0,-1.3; 3 0.95,-1.3; 4 0.95,1.3; 5 -0.95,1.3
DFN-6-3X3-SI7021 = smd 0.8 x 0.5: DATA 1.5,-1; GND 1.5,0; NC@3 1.5,1; NC@4 -1.5,1; SCK -1.5,-1; VDD -1.5,0
DFN-8 = smd 0.3 x 0.7: P$1 -0.75,-0.99; P$2 -0.25,-0.99; P$3 0.25,-0.99; P$4 0.75,-0.99; P$5 0.75,0.99; P$6 0.25,0.99; P$7 -0.25,0.99; P$8 -0.75,0.99 | smd 1.38 x 0.8: P$9 0,0
QFN-16_0.5MM = smd 0.8 x 0.3: 1 -1.275,1; 2 -1.275,0.5; 3 -1.275,0; 4 -1.275,-0.5; 5 -1.275,-1; 9 1.275,-1; 10 1.275,-0.5; 11 1.275,0; 12 1.275,0.5; 13 1.275,1 | smd 0.3 x 0.8: 6 -0.5,-1.275; 7 0,-1.275; 8 0.5,-1.275; 14 0.5,1.275; 15 0,1.275; 16 -0.5,1.275
TFT_1.8_1.44_OLED_0.96_OLED_0.96_I2C = drill 1 pad 1.778: GND -4.17,11.63; SCL 0.91,11.63; SDA 3.45,11.63; VCC -1.63,11.63 | hole 2: -10.67,-11.97; 10.03,-11.97; 10.03,11.33; -10.67,11.33
OLGA-14 = smd 0.75 x 0.35: 1 -1.2,2.4; 2 -1.2,1.6; 3 -1.2,0.8; 4 -1.2,0; 5 -1.2,-0.8; 6 -1.2,-1.6; 7 -1.2,-2.4; 8 1.2,-2.4; 9 1.2,-1.6; 10 1.2,-0.8; 11 1.2,0; 12 1.2,0.8; 13 1.2,1.6; 14 1.2,2.4
32005-601 = drill 0.7 pad 1.016: 1 2.825,1.6; 2 1.625,0.8; 3 2.825,0; 4 1.625,-0.8; 5 2.825,-1.6 | drill 1 pad 1.422 long: M1 -2.225,3.65; M2 -2.225,-3.65
LED3MM = drill 0.813 octagon: A -1.27,0; K 1.27,0

### Placement (x,y rotation side)
C1  2.15,42.97 0 top
C2  3.79,23.39 0 top
C3  2.34,31.97 0 top
C4  32.07,21.86 0 top
C5  32.16,19.26 0 top
C6  32.25,16.56 0 top
C7  31.84,26.56 0 top
C8  52.93,25.56 0 top
C9  53.02,22.96 0 top
C10  68.61,10.26 0 top
C11  59.8,14.66 0 top
C12  48.29,15.56 0 top
C13  59.98,11.66 0 top
C14  60.06,8.77 0 top
C15  45.65,32.17 0 top
C16  75.44,9.97 0 top
C17  48.73,9.07 0 top
C18  79.42,15.17 0 top
C19  79.61,12.27 0 top
C20  58.8,44.47 0 top
C21  63.59,22.77 0 top
C22  79.88,9.17 0 top
C23  58.77,41.37 0 top
C24  58.96,38.07 0 top
D1  69.46,22.67 0 top
D2  69.77,18.77 0 top
D3  13.48,16.57 0 top
D5  32.98,3.24 90 top
F1  12.26,10.34 0 top
J1  34.36,42.7 90 top
JP1  86.77,4.6 90 top
JP2  76.03,3.2 0 top
Q1  23,10.61 90 top
Q4  74.92,24.07 0 top
Q5  75.39,19.5 0 top
R1  2.47,39.64 0 top
R2  2.46,35.94 0 top
R3  2.45,45.54 0 top
R4  36.54,15.34 0 top
R5  36.43,11.54 0 top
R6  12.82,6.84 0 top
R7  12.81,4.64 0 top
R8  36.4,13.34 0 top
R9  36.49,9.64 0 top
R10  10.98,1.84 0 top
R11  29.77,29.04 0 top
R12  43.16,44.34 0 top
R13  52.85,30.04 0 top
R14  52.84,27.94 0 top
R15  29.63,31.04 0 top
R16  52.82,32.24 0 top
R17  43.21,46.54 0 top
R18  52.96,20.35 0 top
R19  29.65,33.55 0 top
R20  28.14,22.85 0 top
R21  57.73,29.15 0 top
R22  35.62,52.55 90 top
R23  57.91,26.65 0 top
R24  28.1,24.95 0 top
R25  13.39,14.25 0 top
R26  13.08,20.85 0 top
R27  12.97,18.45 0 top
R28  48.36,13.35 0 top
R29  48.35,11.55 0 top
R30  48.24,17.75 0 top
R31  45.73,29.35 0 top
R32  45.52,26.75 0 top
R33  63.61,25.25 0 top
R34  82.6,20.35 0 top
R35  63.59,20.35 0 top
R36  82.58,24.75 0 top
R37  63.56,18.16 0 top
R38  43.05,42.06 0 top
R39  82.64,22.46 0 top
R40  43.03,39.46 0 top
R41  82.62,18.16 0 top
R42  43.21,36.86 0 top
R43  48.8,6.76 0 top
R44  48.79,4.56 0 top
R45  48.88,2.16 0 top
RGBD6  41.09,4.7 270 top
S1  46.17,52.71 0 top
S2  DTS-3  [DTS-3']  5.31,16.71 0 top
S3  22.79,2.49 0 top
SV1  63.4,3.19 0 top
U1  42.7,13.07 0 top
U2  15.13,39.31 0 top
U3  39,21.58 0 top
U4  21.36,18.08 0 top
U5  68.56,14.09 0 top
U6  MCP73831  [SOT23-5']  54.44,16.69 0 top
U7  53.46,37.26 0 top
U8  74.95,13.79 0 top
U9  54.75,10.37 0 top
U10  50.78,43.77 0 top
U11  76.13,40.84 0 top
U12  86.62,13.44 0 top
X2  5.1,6.31 0 top
YELLOWD4  33.57,6.39 0 top

### Tracks (layer width: path | path; a pad name or v marks a point on that pad's centre or on a via)
1.8V
  Top 0.152: 87.48,13.56 87.78,13.56 U12.11 87.48,13.56 | 87.48,13.56 86.11,14.94 86.11,16.15 84.28,17.98 | 84.28,17.98 84.12,18.14 83.52,18.14 R41.2 | 84.28,17.98 84.28,21.03 83.52,21.79 83.52,22.4 R39.2 | Q5.1 74.37,18.44 74.07,18.14 74.07,15.24 U8.5 74.07,15.09 74.83,15.09 77.57,12.34 78.64,12.34 C19.1 78.79,12.19 78.94,12.04 78.94,9.3 C22.1 79.1,9.14 79.86,8.38 83.67,8.38 86.11,10.82 86.11,11.89 87.48,13.26 87.48,13.56
+5V  (via drill 0.35)
  Top 0.152: 72.24,19.36 72.24,6.86 75.89,3.2 JP2.2 | 72.24,19.36 72.24,20.27 70.71,21.79 70.71,22.55 D1.A | U3.4 37.8,17.07 37.34,17.07 U3.3 37.19,17.22 37.19,17.68 37.03,17.83 v37.03,18.14 | v35.66,21.79 34.59,21.79 U3.42 | v37.95,28.96 30.63,28.96 R11.2 | v41,24.99 41,24.69 39.62,23.32 v37.8,23.32 | v42.82,16.31 44.35,16.31 44.96,15.7 47.4,15.7 C12.1 | v50.14,18.59 50.9,17.83 v50.9,16.15 50.9,14.94 50.6,14.63 49.07,14.63 47.85,13.41 47.55,13.41 R28.1 | v55.32,16.61 55.32,17.83 | 55.32,17.83 55.32,17.98 U6.4 55.32,17.83 | v14.94,8.99 13.72,10.21 F1.2 | v71.93,19.36 72.24,19.36 | v58.06,19.36 56.54,17.83 55.32,17.83
  Bottom 0.152: v37.95,28.96 41,25.91 v41,24.99 | v37.8,23.32 37.19,23.32 v35.66,21.79 35.66,19.51 v37.03,18.14 39.17,16 39.17,14.94 | 39.17,14.94 39.47,14.63 40.08,14.63 41.76,16.31 v42.82,16.31 43.13,16.31 45.41,18.59 v50.14,18.59 | v55.32,16.61 53.03,16.61 52.58,16.15 v50.9,16.15 | v14.94,8.99 27.74,8.99 30.94,12.19 36.42,12.19 39.17,14.94 | v58.06,19.36 v71.93,19.36
ACC_INT  (via drill 0.35)
  Top 0.152: v53.65,42.98 52.88,43.74 52.12,43.74 U10.11 | v53.65,36.58 53.34,36.58 51.97,35.2 40.08,35.2 39.17,34.29 27.28,34.29 24.84,31.85 24.54,31.85 U2.P$33
  Bottom 0.152: v53.65,36.58 v53.65,42.98
COMSTATUS  (via drill 0.35)
  Top 0.152: v47.24,5.64 47.85,6.25 47.85,6.71 R43.1 | v33.53,5.49 30.79,5.49 27.89,8.38 v27.89,21.03 | v17.98,26.06 17.98,25.3 17.53,24.84 U2.P$24
  Bottom 0.152: v47.24,5.64 35.36,5.64 35.2,5.49 v33.53,5.49 | v27.89,21.03 30.48,23.62 30.48,24.23 27.89,26.82 24.08,26.82 22.4,28.5 20.42,28.5 v17.98,26.06
DBG_EN  (via drill 0.35)
  Top 0.152: v56.69,27.89 53.8,27.89 R14.2 | v58.37,27.89 58.37,26.98 58.67,26.67 R23.2 | v19.66,21.79 19.66,19.05 U4.1 | v22.1,35.36 v22.1,27.89 | v56.84,44.5 v55.17,46.18
  Bottom 0.152: v56.69,27.89 v58.37,27.89 58.52,27.74 60.5,27.74 61.42,28.65 61.42,36.58 56.84,41.15 v56.84,44.5 | v19.66,21.79 19.66,25.45 v22.1,27.89 | v22.1,35.36 29.72,35.36 36.73,42.37 38.1,42.37 39.32,43.59 41.91,43.59 43.28,44.96 51.05,44.96 52.27,46.18 v55.17,46.18
DBG_NRST  (via drill 0.35)
  Top 0.152: v50.9,27.74 44.96,21.79 43.59,21.79 U3.19 | v59.59,28.35 58.67,29.26 R21.2 | v15.24,23.16 19.2,23.16 20.27,22.1 20.27,20.73 22.55,18.44 23.16,18.44 U4.7 | v52.58,33.68 v51.66,34.59
  Bottom 0.152: 52.58,27.74 55.63,27.74 56.39,28.5 59.44,28.5 v59.59,28.35 | 52.58,27.74 v50.9,27.74 | v15.24,23.16 12.65,25.76 12.65,26.36 21.03,34.75 29.57,34.75 36.88,42.06 38.25,42.06 39.47,43.28 42.06,43.28 43.13,44.35 48.46,44.35 51.66,41.15 v51.66,34.59 | 52.58,27.74 v52.58,33.68
DEVSTATUS  (via drill 0.35)
  Top 0.152: v11.89,12.5 13.56,12.5 20.88,5.18 32.92,5.18 33.38,4.72 46.63,4.72 46.79,4.57 47.85,4.57 R44.1 | v18.9,26.06 18.9,24.99 18.75,24.84 U2.P$25
  Bottom 0.152: v11.89,12.5 11.89,19.96 10.21,21.64 10.21,22.25 10.52,22.55 13.41,22.55 14.33,21.64 15.54,21.64 18.9,24.99 v18.9,26.06
DVDD  (via drill 0.35)
  Top 0.152: U5.5 67.51,15.54 67.06,15.54 64.47,18.14 R37.2 64.47,18.29 64.47,20.27 R35.2 64.47,20.42 64.92,20.88 | U12.10 87.78,12.5 87.78,11.89 U12.9 87.78,11.73 87.48,11.73 83.82,8.08 78.64,8.08 77.11,9.6 77.11,12.34 74.98,14.48 73.61,14.48 72.54,15.54 72.54,21.95 71.17,23.32 69.95,23.32 | 69.95,23.32 69.95,22.1 70.87,21.18 70.87,18.9 D2.A | 69.95,23.32 69.8,23.47 67.51,23.47 66.45,22.4 | 64.92,20.88 66.45,22.4 | 66.45,22.4 65.23,23.62 64.62,23.62 63.09,25.15 62.79,25.15 R33.1 | v43.43,13.56 43.89,14.02 44.65,14.02 U1.8 | 59.59,3.5 57.91,5.18 57.91,6.4 59.13,7.62 59.13,8.69 C14.1 59.13,8.84 59.13,11.58 C13.1 58.98,11.73 57.76,12.95 57.76,15.39 58.98,16.61 58.98,20.42 62.18,23.62 63.4,23.62 63.55,23.47 63.55,22.25 64.92,20.88 | 59.59,3.5 SV1.2 59.59,3.5 | 59.59,3.5 60.96,4.88 67.51,4.88 69.19,3.2 69.65,3.2 SV1.6 | v46.79,9.91 44.35,7.47 44.35,6.71 RGBD6.2 | C15.1 44.65,32.16 44.35,32.16 38.71,26.52 38.71,26.21 U3.31 38.71,26.06 38.71,25.6 v37.8,24.69 | 35.66,15.24 35.66,13.41 R8.1 35.51,13.41 34.14,13.41 33.83,13.11 33.83,12.5 34.75,11.58 35.51,11.58 R5.1 | v13.11,19.51 12.19,18.59 R27.1 | v22.4,19.81 23.16,19.05 U4.8 | v34.59,15.24 35.66,15.24 | 35.66,15.24 R4.1 | R23.1 57.15,26.67 57.15,27.43 57.3,27.58 57.3,28.8 57,29.11 R21.1 56.84,29.26 | 56.84,29.26 56.84,30.48 55.17,32.16 53.8,32.16 R16.2 53.65,32.31 v53.65,34.75 | R32.2 46.48,26.82 46.48,29.26 R31.2 46.63,29.41 49.99,29.41 51.36,30.79 52.73,30.79 52.88,30.63 52.88,29.26 | 45.72,19.36 43.59,19.36 U3.14 | 45.72,19.36 49.23,22.86 52.12,22.86 C9.1 | C9.1 52.12,23.01 52.12,25.45 C8.1 52.12,25.6 52.88,26.36 52.88,29.26
  Top 0.152: R18.2 53.8,20.42 53.8,21.34 52.27,22.86 C9.1 | 52.88,29.26 56.84,29.26 | 42.06,37.95 41.45,37.34 41.45,36.27 41.6,36.12 43.43,36.12 44.04,36.73 R42.2 44.2,36.88 44.5,37.19 51.82,37.19 U7.VDD 51.97,37.34 52.27,37.34 v53.03,38.1 | 42.06,37.95 43.43,39.32 43.74,39.32 R40.2 | 41.3,40.08 41.45,40.23 41.76,40.23 43.43,41.91 43.89,41.91 R38.2 | 41.3,40.08 41.3,38.71 42.06,37.95 | 41.3,40.08 38.71,42.67 34.9,42.67 J1.4 | C23.1 57.91,41.45 57.91,44.35 C20.1 57.91,44.5 v57.91,45.57 | 51.21,45.57 51.05,45.72 49.99,45.72 49.53,45.26 49.53,44.81 U10.1 | 51.21,45.57 51.21,45.11 U10.14 | v52.58,45.57 51.21,45.57 | 45.72,19.36 v45.72,17.37
  Bottom 0.152: 46.94,10.06 48.46,8.53 51.66,8.53 55.32,4.88 57.91,4.88 SV1.2 | 46.94,10.06 v43.43,13.56 43.43,15.09 v45.72,17.37 | 46.94,10.06 v46.79,9.91 | v13.11,19.51 22.1,19.51 v22.4,19.81 26.98,15.24 32.16,15.24 | 32.16,15.24 v34.59,15.24 | 32.16,15.24 32.16,21.03 33.53,22.4 35.51,22.4 v37.8,24.69 37.8,24.99 35.97,26.82 35.97,27.43 36.27,27.74 36.88,27.74 39.47,25.15 39.47,24.69 39.78,24.38 41.3,24.38 44.5,27.58 45.57,27.58 52.73,34.75 v53.65,34.75 53.65,35.2 53.03,35.81 v53.03,38.1 53.03,45.57 | 53.03,45.57 v57.91,45.57 62.33,45.57 67.97,51.21 73.15,51.21 74.37,52.43 U11.VCC | 53.03,45.57 v52.58,45.57
FT_SK  (via drill 0.35)
  Top 0.152: v55.02,31.39 53.8,30.18 R13.2 | v55.02,44.96 54.56,44.96 53.03,46.48 v49.38,46.48 | v15.24,22.25 18.14,22.25 18.59,21.79 18.59,18.75 18.9,18.44 19.51,18.44 U4.2
  Bottom 0.152: v55.02,44.96 v55.02,31.39 | v49.38,46.48 48.92,46.48 47.7,45.26 41.45,45.26 40.08,43.89 38.25,43.89 37.03,42.67 35.66,42.67 28.96,35.97 21.79,35.97 12.34,26.52 12.34,25.45 14.63,23.16 14.63,22.86 v15.24,22.25
FTDI_RX
  Top 0.152: R19.2 30.48,33.53 30.18,33.53 28.8,32.16 28.04,32.16 26.67,30.79 26.67,26.98 23.47,23.77 11.73,23.77 10.82,24.69 U2.P$19
FTDI_TX  (via drill 0.35)
  Top 0.152: v31.7,31.09 30.48,31.09 R15.2 | v36.73,38.71 36.73,40.69 v36.58,40.84 | v13.26,26.06 12.34,25.15 12.34,24.84 U2.P$20
  Bottom 0.152: v31.7,31.09 31.7,33.68 v36.73,38.71 | v36.58,40.84 36.12,40.84 26.82,31.55 18.75,31.55 v13.26,26.06
GND  (via drill 0.35)
  Top 0.152: 29.26,35.97 33.98,35.97 35.81,37.8 35.81,39.93 35.36,40.39 34.9,40.39 J1.6 34.75,40.54 33.53,40.54 32.46,41.6 32.46,45.26 36.73,49.53 37.34,49.53 J1.S4 37.49,49.68 47.4,49.68 | 47.4,49.68 47.4,50.6 49.38,52.58 S1.2 | 47.4,49.68 47.4,43.13 47.7,42.82 49.38,42.82 U10.5 | 24.23,26.21 24.38,26.36 U2.P$29 24.23,26.21 | 24.23,26.21 22.86,24.84 U2.P$28 | J1.S3 29.11,49.53 25.76,46.18 24.54,46.18 U2.P$44 24.38,46.02 23.77,46.02 22.55,44.81 22.55,44.2 22.71,44.04 22.71,36.58 | 24.23,26.21 22.71,27.74 22.71,36.58 | U4.4 19.51,17.07 17.53,15.09 13.56,15.09 13.41,14.94 13.41,13.72 13.11,13.41 11.89,13.41 11.73,13.56 11.73,14.94 12.5,15.7 14.94,15.7 15.39,16.15 15.39,18.29 14.02,19.66 14.02,20.73 R26.2 13.87,20.88 13.87,21.18 v11.89,23.16 | U2.P$1 5.79,45.72 4.88,45.72 2.74,43.59 2.29,43.59 1.68,42.98 C1.1 1.68,42.82 1.68,39.78 R1.1 1.68,39.62 1.68,37.34 v1.98,37.03 | 6.1,22.25 1.37,22.25 1.22,22.4 1.22,25.15 2.74,26.67 2.74,31.85 C3.2 | 6.1,22.25 8.08,24.23 8.08,24.69 U2.P$17 8.08,24.84 8.08,30.79 6.25,32.61 5.94,32.61 U2.P$11 | 6.1,22.25 v6.4,21.95 | v21.95,36.58 22.71,36.58 | v29.26,37.19 29.26,35.97 | 29.26,35.97 J1.S2 | U3.45 34.59,20.42 35.2,20.42 36.27,21.49 36.27,23.93 34.44,25.76 31.85,25.76 31.09,26.52 C7.1 31.09,26.67 31.09,27.74 31.7,28.35 36.27,28.35 37.64,26.98 | C6.1 31.39,16.61 31.39,19.2 C5.1 31.39,19.36 31.39,20.27 | 31.39,20.27 32.92,21.79 C4.2 | 29.41,22.4 30.33,21.49 30.33,21.34 31.39,20.27 | 29.41,22.4 29.11,22.71 R20.2 29.41,22.4 | 42.67,13.72 42.82,13.56 42.82,13.26 43.89,12.19 44.65,12.19 U1.5 | 42.67,13.72 41,15.39 | 41,15.39 40.23,16.15 40.23,17.07 U3.9
  Top 0.152: 41.76,22.71 41.76,22.55 42.98,21.34 | 41.76,22.71 41.76,26.06 U3.25 | 42.98,21.34 43.43,21.34 U3.18 | 37.19,22.71 37.19,26.06 U3.34 37.34,26.21 37.34,26.67 37.64,26.98 | 37.19,22.71 37.19,21.49 35.05,19.36 34.59,19.36 U3.47 | 37.64,26.98 v41.91,31.24 43.59,32.92 45.57,32.92 46.18,32.31 46.48,32.31 C15.2 | v39.01,35.05 38.25,35.81 37.49,35.81 J1.S1 | 37.19,22.71 41.76,22.71 | 41,15.39 42.67,17.07 42.67,21.03 42.98,21.34 | 29.41,22.4 30.48,23.47 30.48,25.15 28.35,27.28 v28.35,27.89 | 66.9,13.41 62.64,13.41 61.27,12.04 | 66.9,13.41 67.97,13.41 68.12,13.26 68.12,13.11 68.43,12.8 U5.2 | 61.27,12.04 60.96,11.73 C13.2 | 61.27,12.04 62.33,10.97 62.33,10.21 60.96,8.84 C14.2 60.81,8.69 v59.74,7.62 | 61.27,12.04 C13.2 | C11.2 60.5,14.78 59.89,15.39 58.22,15.39 58.06,15.24 58.06,14.02 59.59,12.5 60.05,12.5 60.81,11.73 C13.2 | 66.9,13.41 66.9,9.6 67.06,9.45 68.58,9.45 69.34,10.21 C10.2 69.49,10.21 v71.63,10.21 | C8.2 53.8,25.45 53.8,23.01 C9.2 53.95,22.86 53.95,21.64 54.71,20.88 54.71,15.54 54.56,15.39 U6.2 54.56,15.24 54.56,12.95 55.02,12.5 55.02,11.43 U9.P$6 55.02,11.28 55.02,10.67 54.86,10.52 U9.P$9 | R30.2 49.07,17.68 49.07,15.7 C12.2 49.23,15.54 49.99,15.54 v50.29,15.24 | 54.1,9.6 54.1,9.91 54.71,10.52 U9.P$9 | 54.1,9.6 54.1,9.45 U9.P$1 54.1,9.6 | U9.P$9 54.86,10.36 55.47,9.75 55.47,9.45 U9.P$4 55.63,9.3 57,7.92 57,3.2 SV1.1 | 54.1,9.6 52.27,9.6 51.82,9.14 49.68,9.14 C17.2 49.53,9.14 49.07,9.6 v49.07,10.21 | v47.55,10.52 47.55,11.43 R29.1 | 42.67,13.72 43.89,14.94 v44.35,14.94 | U12.12 87.94,14.17 88.24,13.87 88.39,13.87 88.54,13.72 88.54,5.33 86.87,3.66 JP1.1 86.72,3.66 78.49,3.66
  Top 0.152: U8.2 74.98,12.34 74.98,11.28 76.2,10.06 C16.2 76.35,9.91 76.35,8.23 78.49,6.1 78.49,3.66 | 78.49,3.66 78.49,3.2 JP2.3 78.49,3.66 | 81.53,13.41 85.34,13.41 U12.4 | 81.53,13.41 80.47,12.34 C19.2 80.47,12.19 80.62,12.04 80.62,9.3 C22.2 80.77,9.14 80.92,8.99 v81.84,8.99 | 81.53,13.41 80.31,14.63 80.31,15.09 C18.2 80.16,15.24 80.16,16 76.35,19.81 74.83,19.81 72.85,21.79 72.85,22.1 68.28,26.67 64.01,26.67 61.11,29.57 60.2,29.57 | C20.2 59.59,44.35 59.59,41.45 C23.2 59.74,41.3 59.74,38.1 C24.2 59.74,37.95 59.13,37.34 | U10.12 51.97,44.2 51.51,44.2 51.36,44.04 51.36,43.59 51.66,43.28 51.97,43.28 U10.10 52.12,43.28 52.43,43.28 54.25,41.45 54.25,37.95 54.86,37.34 U7.GND 55.02,37.34 59.13,37.34 | 60.2,29.57 60.2,36.27 59.13,37.34 | 60.2,29.57 60.2,26.36 62.18,24.38 63.09,24.38 64.31,23.16 64.31,22.86 C21.2 | U11.GND 71.93,52.43 71.93,51.05 65.38,44.5 59.74,44.5 C20.2 | v59.13,49.68 58.52,49.07 58.52,45.57 59.59,44.5 C20.2
  Bottom 0.152: v6.4,21.95 6.4,16.46 7.92,14.94 7.92,7.92 X2.1 | v1.98,37.03 1.98,26.36 v6.4,21.95 | v6.4,21.95 7.62,23.16 v11.89,23.16 11.89,26.52 v21.95,36.58 22.55,37.19 v29.26,37.19 | 39.01,34.14 v39.01,35.05 | v41.91,31.24 39.01,34.14 | v28.35,27.89 30.94,30.48 35.36,30.48 39.01,34.14 | 48.77,10.52 v47.55,10.52 | 48.77,10.52 v49.07,10.21 50.44,10.21 53.03,7.62 v59.74,7.62 | 50.29,14.94 50.29,12.04 48.77,10.52 | 50.29,14.94 v44.35,14.94 | 50.29,14.94 v50.29,15.24 | JP1.1 86.72,3.66 86.72,4.12 v81.84,8.99 80.62,10.21 v71.63,10.21 | v59.13,49.68 56.24,52.58 49.53,52.58 S1.2
GPIO28  (via drill 0.35)
  Top 0.152: v71.48,2.9 69.8,1.22 49.07,1.22 48.16,2.13 R45.1 | v61.72,47.4 v66.45,47.4 | v26.21,42.22 24.54,42.22 U2.P$41
  Bottom 0.152: v71.48,2.9 71.48,3.35 73.15,5.03 82.45,5.03 85.34,2.13 87.33,2.13 88.24,3.05 88.24,23.77 73.15,38.86 73.15,40.69 v66.45,47.4 | v61.72,47.4 53.95,47.4 53.19,48.16 50.14,48.16 48.16,46.18 44.5,46.18 43.89,45.57 41.3,45.57 39.93,44.2 38.1,44.2 36.88,42.98 35.51,42.98 35.05,42.52 26.52,42.52 v26.21,42.22
LV_SCL
  Top 0.152: U12.2 85.34,15.09 85.04,15.09 82.6,17.53 82.6,21.49 81.69,22.4 R39.1
LV_SDA
  Top 0.152: U12.3 85.34,14.33 85.04,14.63 84.89,14.63 81.84,17.68 81.84,18.14 R41.1 81.69,18.29 79.55,20.42 75.44,20.42 Q5.3
N$2
  Top 0.152: U2.P$38 24.54,38.41 24.84,38.41 36.12,49.68 36.12,50.44 38.25,52.58 42.82,52.58 S1.1
N$3
  Top 0.152: R2.2 3.35,35.97 3.35,37.03 5.49,39.17 5.79,39.17 U2.P$6
N$29  (via drill 0.35)
  Top 0.152: v38.71,19.66 38.71,17.22 U3.6 | v36.58,27.13 35.2,27.13 v34.75,27.58 | v31.24,24.08 31.24,21.95 C4.1
  Bottom 0.152: v38.71,19.66 38.71,24.99 v36.58,27.13 | v34.75,27.58 34.75,27.28 31.55,24.08 v31.24,24.08
N$37  (via drill 0.35)
  Top 0.152: v40.08,18.14 39.78,17.83 39.78,17.22 U3.8 | v44.04,18.14 45.41,16.76 v46.48,16.76 | v26.98,4.42 16,4.42 13.72,6.71 R6.2
  Bottom 0.152: v44.04,18.14 v40.08,18.14 | v46.48,16.76 52.73,16.76 53.19,17.22 55.93,17.22 60.81,12.34 60.81,2.44 59.89,1.52 29.87,1.52 v26.98,4.42
N$40  (via drill 0.35)
  Top 0.152: v39.32,18.9 39.32,17.22 U3.7 | v39.32,23.93 39.32,24.23 v40.08,24.99 | v12.5,5.79 13.56,4.72 R7.2 13.56,4.57 12.8,3.81 12.34,3.81 10.52,1.98 10.21,1.98 R10.1
  Bottom 0.152: v39.32,23.93 v39.32,18.9 | v40.08,24.99 37.03,28.04 36.12,28.04 28.5,20.42 13.11,20.42 12.5,19.81 v12.5,5.79
N$41  (via drill 0.35)
  Top 0.152: v41.91,13.56 41.91,14.02 41.3,14.63 39.47,14.63 39.17,14.94 39.17,15.7 38.25,16.61 38.25,17.07 U3.5 | v12.8,2.9 11.89,1.98 R10.2
  Bottom 0.152: v41.91,13.56 41.45,13.56 37.19,9.3 29.11,9.3 23.77,3.96 23.77,2.13 23.16,1.52 22.4,1.52 21.79,2.13 21.79,2.74 20.57,3.96 13.87,3.96 v12.8,2.9
N$42  (via drill 0.35)
  Top 0.152: v32.77,20.73 33.22,20.73 33.83,21.34 34.44,21.34 U3.43 | v32.92,18.14 32.92,19.2 C5.2
  Bottom 0.152: 32.77,18.14 32.77,17.98 35.2,15.54 35.2,14.94 33.53,13.26 30.63,13.26 Q1.2 | 32.77,18.14 v32.77,20.73 | 32.77,18.14 v32.92,18.14
N$44
  Top 0.152: U3.44 34.44,20.88 33.83,20.88 33.07,20.12 32.46,20.12 32.16,19.81 32.16,17.53 33.07,16.61 C6.2 33.07,16.46 33.07,13.87 30.63,11.43 30.63,8.08 Q1.1
N$45  (via drill 0.35)
  Top 0.152: v35.51,16.46 35.51,17.37 35.97,17.83 36.42,17.83 36.73,17.53 36.73,17.22 U3.2 | v34.44,12.8 34.75,12.5 39.17,12.5 | 39.17,12.5 39.62,12.5 39.78,12.65 40.54,12.65 U1.3 | v42.06,15.54 44.65,15.54 45.87,14.33 45.87,11.89 43.74,9.75 37.49,9.75 R9.2 | 39.17,12.5 v39.17,12.65
  Bottom 0.152: v35.51,16.46 35.51,13.87 v34.44,12.8 | v39.17,12.65 v42.06,15.54
N$48
  Top 0.152: R9.1 35.66,9.75 37.34,11.43 R5.2 37.34,11.58 37.8,12.04 40.54,12.04 U1.4
N$49
  Top 0.152: U3.1 36.27,17.07 36.27,16.15 36.58,15.85 36.58,14.02 37.19,13.41 R8.2 37.34,13.41 40.54,13.41 U1.2
N$50  (via drill 0.35)
  Top 0.152: v34.59,18.14 34.59,18.75 U3.48 | 38.25,15.39 37.49,15.39 R4.2 | 38.25,15.39 39.47,14.17 40.54,14.17 U1.1 | 38.25,15.39 v38.56,15.39
  Bottom 0.152: v34.59,18.14 35.81,18.14 v38.56,15.39
N$51  (via drill 0.35)
  Top 0.152: U3.46 34.59,19.81 35.05,19.81 36.58,21.34 36.58,24.08 34.14,26.52 32.77,26.52 C7.2 32.61,26.67 32,27.28 v32,27.74 | v29.26,27.89 28.96,28.19 28.96,28.96 R11.1
  Bottom 0.152: v29.26,27.89 31.85,27.89 v32,27.74
N$52
  Top 0.152: U3.24 43.59,24.38 46.33,24.38 51.97,30.02 R13.1
N$53
  Top 0.152: U3.17 43.59,20.88 44.96,20.88 51.97,27.89 R14.1
N$54
  Top 0.152: U3.10 40.69,17.22 40.69,18.59 39.01,20.27 37.8,20.27 33.98,16.46 33.98,13.72 33.53,13.26 33.53,10.36 35.05,8.84 43.28,8.84 46.63,12.19 46.63,13.87 47.55,14.78 48.16,14.78 48.31,14.94 48.31,18.44 50.14,20.27 51.97,20.27 R18.1
N$55
  Top 0.152: U3.40 34.44,22.86 33.53,22.86 30.63,25.76 30.33,25.76 29.87,26.21 29.87,28.35 29.72,28.5 29.72,30.02 28.8,30.94 R15.1
N$56  (via drill 0.35)
  Top 0.152: v35.66,23.62 35.36,23.32 34.59,23.32 U3.39 | v35.51,26.06 35.05,26.06 v33.83,27.28 | v26.06,30.94 28.65,33.53 R19.1
  Bottom 0.152: v35.66,23.62 35.66,25.91 v35.51,26.06 | v33.83,27.28 32.46,27.28 32.31,27.13 25.6,27.13 25.3,27.43 25.3,30.18 v26.06,30.94
N$57
  Top 0.152: U3.26 41.3,26.21 41.3,27.28 45.41,31.39 51.21,31.39 51.97,32.16 R16.1
N$58
  Top 0.152: R20.1 27.28,22.71 27.28,20.57 23.93,17.22 23.32,17.22 U4.5
N$59
  Top 0.152: R25.1 12.65,14.33 12.65,14.63 13.41,15.39 16.61,15.39 18.9,17.68 19.51,17.68 U4.3
N$60
  Top 0.152: D3.A 14.48,16.61 14.48,17.83 13.87,18.44 R27.2
N$61
  Top 0.152: R24.1 27.13,24.84 27.13,24.08 24.08,21.03 24.08,18.14 23.77,17.83 23.32,17.83 U4.6
N$62
  Top 0.152: R26.1 12.19,20.73 6.1,20.73 2.13,16.76 S2.1
N$63  (via drill 0.35)
  Top 0.152: v56.54,11.28 55.63,11.28 U9.P$5 | v61.72,10.52 v60.2,10.52 | v58.52,6.1 v62.64,6.1 | v52.88,6.1 v56.08,6.1 | v34.75,2.44 32.92,2.44 32.16,3.2 D5.C
  Bottom 0.152: v56.54,11.28 59.44,11.28 v60.2,10.52 | v61.72,10.52 61.72,7.01 v62.64,6.1 | v56.08,6.1 v58.52,6.1 | v52.88,6.1 49.23,2.44 v34.75,2.44
N$64  (via drill 0.35)
  Top 0.152: v32.77,4.42 33.83,3.35 D5.A | v30.33,6.86 30.02,6.86 28.5,8.38 28.5,21.95 28.19,22.25 28.19,24.23 28.04,24.38 28.04,25.76 27.58,26.21 27.58,31.24 28.19,31.85 32.92,31.85 33.07,31.7 41.15,31.7 42.67,33.22 52.12,33.22 52.27,33.07 52.58,33.07 52.88,32.77 52.88,31.55 v53.34,31.09 | v60.81,28.96 64.47,25.3 R33.2
  Bottom 0.152: v30.33,6.86 v32.77,4.42 | v53.34,31.09 54.41,31.09 56.54,28.96 v60.81,28.96
N$65
  Bottom 0.152: S3.2 22.86,2.59 22.86,3.66 29.72,10.52 37.95,10.52 45.41,17.98 55.78,17.98 56.84,16.92 75.44,16.92 86.72,5.64 JP1.2
N$66
  Top 0.152: R29.2 49.23,11.58 49.23,11.89 51.66,14.33 51.66,16.31 53.34,17.98 U6.5
N$67  (via drill 0.35)
  Top 0.152: v53.49,8.53 50.9,5.94 49.07,5.94 48.77,6.25 48.77,7.47 48.01,8.23 48.01,8.99 C17.1 47.85,8.99 v46.79,8.99 | v55.32,13.87 55.32,15.24 U6.3 | v24.54,3.81 22.86,3.81 21.64,2.59 20.88,2.59 S3.1
  Bottom 0.152: v53.49,8.53 53.49,12.04 v55.32,13.87 | v24.54,3.81 29.72,8.99 v46.79,8.99
N$68  (via drill 0.35)
  Top 0.152: v53.34,14.17 53.34,15.24 U6.1 | v51.36,7.77 v52.58,8.99
  Bottom 0.152: v53.34,14.17 53.34,13.72 52.58,12.95 v52.58,8.99 | v51.36,7.77 51.36,6.55 51.05,6.25 34.9,6.25 YELLOWD4.K
N$69  (via drill 0.35)
  Top 0.152: v49.23,7.92 48.77,8.38 48.77,9.6 48.31,10.06 48.31,12.04 49.07,12.8 49.07,13.26 R28.2
  Bottom 0.152: v49.23,7.92 48.16,7.92 47.55,7.32 41.6,7.32 41.3,7.62 33.53,7.62 YELLOWD4.A
N$70
  Top 0.152: F1.1 10.82,10.21 8.08,10.21 5.49,7.62 5.49,5.49 6.4,4.57 7.92,4.57 X2.5
N$71
  Top 0.152: 67.67,11.89 67.67,10.36 C10.1 | 67.67,11.89 67.67,12.65 U5.1 | 67.67,11.89 68.89,11.89 69.19,12.19 69.19,12.34 69.49,12.65 U5.3 69.65,12.8 69.65,14.48 70.1,14.94 70.1,17.68 69.04,18.75 D2.C 68.89,18.9 68.89,22.4 68.73,22.55 D1.C
N$72
  Top 0.152: U5.4 69.49,15.39 69.49,14.78 68.58,13.87 59.74,13.87 58.98,14.63 C11.1
N$73
  Top 0.152: U8.4 76.05,15.24 78.49,15.24 C18.1
N$74  (via drill 0.35)
  Top 0.152: v50.75,6.86 49.68,6.86 R43.2 | v41,7.01 38.25,7.01 RGBD6.1
  Bottom 0.152: v50.75,6.86 41.15,6.86 v41,7.01
N$75
  Top 0.152: R44.2 49.53,4.42 49.23,4.42 47.7,2.9 44.5,2.9 44.35,2.74 RGBD6.3
N$76  (via drill 0.35)
  Top 0.152: v48.92,3.2 48.92,3.05 49.68,2.29 R45.2 | v41,3.2 38.41,3.2 37.95,2.74 RGBD6.4
  Bottom 0.152: v41,3.2 v48.92,3.2
N$77
  Top 0.152: U10.2 49.38,44.35 48.92,44.35 48.77,44.5 48.77,44.96 49.99,46.18 52.88,46.18 55.17,43.89 55.17,41 58.06,38.1 C24.1
N$78
  Top 0.152: U10.7 50.75,42.37 50.75,42.06 46.33,37.64 43.13,37.64 42.37,36.88 R42.1
NRESET
  Top 0.152: 12.65,16.46 11.43,15.24 11.43,13.41 11.73,13.11 13.26,13.11 13.72,13.56 13.72,13.72 14.17,14.17 R25.2 | 11.28,17.83 11.28,19.05 12.34,20.12 12.95,20.12 13.11,20.27 13.11,21.49 12.95,21.64 12.5,21.64 10.21,23.93 10.21,25.6 9.91,25.91 9.91,37.95 6.55,41.3 6.4,41.3 5.94,41.76 U2.P$4 | 12.65,16.46 11.28,17.83 | 12.65,16.46 D3.C | 11.28,17.83 10.21,16.76 8.69,16.76 S2.2
PWM  (via drill 0.35)
  Top 0.152: v21.34,39.17 21.34,24.84 U2.P$27 | v48.46,47.85 56.39,47.85 58.83,50.29 63.86,50.29 65.08,49.07 v69.04,49.07
  Bottom 0.152: v21.34,39.17 21.79,39.17 25.76,43.13 34.75,43.13 39.47,47.85 v48.46,47.85 | v69.04,49.07 88.54,29.57 88.54,2.9 87.02,1.37 75.29,1.37 73.61,3.05 JP2.1
PZT  (via drill 0.35)
  Top 0.152: v49.07,21.79 47.4,20.12 47.4,17.83 R30.1 | v58.06,18.44 58.67,17.83 58.67,16.76 57.45,15.54 57.45,4.72 58.67,3.5 58.67,2.13 59.28,1.52 65.68,1.52 67.21,3.05 SV1.5 | v14.94,32.77 14.94,24.84 U2.P$22 | v36.12,45.87 36.42,45.87 v41.45,40.84 | v43.43,25.6 v42.52,26.52
  Bottom 0.152: v49.07,21.79 48.77,21.79 45.26,25.3 45.26,25.91 | 45.26,25.91 45.57,26.21 50.29,26.21 v58.06,18.44 | v14.94,32.77 14.94,37.19 23.62,45.87 v36.12,45.87 | v41.45,40.84 41.45,32.61 42.52,31.55 v42.52,26.52 | v43.43,25.6 44.04,26.21 44.96,26.21 45.26,25.91
RX_SW  (via drill 0.35)
  Top 0.152: v23.16,44.5 23.16,31.39 24.08,30.48 24.38,30.48 U2.P$32 | v62.79,45.11 v59.13,48.77 | v65.99,21.03 65.99,18.59 v68.28,16.31
  Bottom 0.152: v23.16,44.5 35.66,44.5 39.32,48.16 47.85,48.16 48.46,48.77 v59.13,48.77 | v62.79,45.11 62.79,24.23 v65.99,21.03 | v68.28,16.31 67.51,16.31 64.77,13.56 64.77,3.2 SV1.4
SCL  (via drill 0.35)
  Top 0.152: v53.95,13.41 53.95,13.11 54.41,12.65 54.41,11.43 U9.P$7 | v58.06,17.53 v56.39,15.85 | v61.57,17.53 62.03,17.53 62.64,18.14 R37.1 | 48.46,43.89 47.85,44.5 47.85,48.16 50.29,50.6 64.01,50.6 64.62,49.99 67.82,49.99 71.48,53.65 75.89,53.65 76.96,52.58 U11.SCL 77.11,52.43 81.69,47.85 81.69,24.84 R36.1 | 48.46,43.89 49.07,43.28 49.38,43.28 U10.4 | v50.9,36.58 51.21,36.27 51.82,36.27 U7.SCK | 48.46,43.89 v48.01,43.43 | v43.28,43.13 42.22,42.06 R38.1 | v44.81,28.19 44.81,26.82 R32.1 44.81,26.67 v45.87,25.6 | v25.91,28.35 25.3,27.74 24.54,27.74 U2.P$30
  Bottom 0.152: v56.39,15.85 v53.95,13.41 | v61.57,17.53 v58.06,17.53 49.99,25.6 v45.87,25.6 | 48.01,43.13 48.01,42.98 50.9,40.08 v50.9,36.58 44.81,30.48 v44.81,28.19 | 48.01,43.13 v43.28,43.13 42.22,42.06 39.17,42.06 36.12,39.01 36.12,38.56 v25.91,28.35 | 48.01,43.13 v48.01,43.43
SD_CS  (via drill 0.35)
  Top 0.152: v31.85,43.74 25.15,37.03 24.54,37.03 U2.P$37 | v33.22,43.74 34.29,44.81 34.75,44.81 J1.2
  Bottom 0.152: v33.22,43.74 v31.85,43.74
SDA  (via drill 0.35)
  Top 0.152: 45.72,42.37 50.14,42.37 U10.6 | 45.72,42.37 43.59,40.23 42.98,40.23 42.22,39.47 R40.1 | v25.91,29.26 24.54,29.26 U2.P31 | v45.11,43.74 45.11,42.98 45.72,42.37 | 80.92,21.95 81.69,21.18 81.69,20.42 R34.1 | 80.92,21.95 80.92,23.01 81.84,23.93 82.3,23.93 82.6,24.23 82.6,49.53 79.7,52.43 U11.SDA | v50.44,19.51 53.19,19.51 54.1,18.59 54.1,17.37 52.73,16 52.73,13.41 53.95,12.19 53.95,11.43 U9.P$8 | v44.35,25.6 43.89,26.06 43.89,28.35 44.81,29.26 R31.1 | v56.24,18.44 57.91,20.12 v57.91,20.42 57.91,27.28 57.76,27.43 57.76,30.02 55.02,32.77 55.02,36.12 U7.DATA 54.86,36.27 53.95,37.19 53.95,39.93 52.73,41.15 v50.75,41.15 | v60.2,20.42 62.64,20.42 R35.1 | v73.61,21.95 80.92,21.95
  Bottom 0.152: v25.91,29.26 39.01,42.37 41.6,42.37 42.98,43.74 v45.11,43.74 47.4,43.74 47.7,44.04 48.31,44.04 50.75,41.6 v50.75,41.15 | v44.35,25.6 v50.44,19.51 51.51,18.44 v56.24,18.44 | v57.91,20.42 v60.2,20.42 72.08,20.42 v73.61,21.95
SOP2  (via drill 0.35)
  Top 0.152: R1.2 3.35,39.78 4.88,39.78 5.49,40.39 5.79,40.39 U2.P$5 5.94,40.39 6.25,40.39 8.84,37.8 8.84,23.93 v10.82,21.95 | v29.87,23.93 28.96,24.84 R24.2
  Bottom 0.152: v29.87,23.93 22.71,23.93 19.96,21.18 11.58,21.18 v10.82,21.95
SPI_MISO
  Top 0.152: U2.P$35 24.54,34.44 25.6,34.44 30.48,39.32 34.75,39.32 J1.7
SPI_MOSI  (via drill 0.35)
  Top 0.152: v31.85,41.15 26.52,35.81 24.54,35.81 U2.P$36 | v33.07,41.91 33.07,42.52 34.29,43.74 34.75,43.74 J1.3
  Bottom 0.152: v31.85,41.15 32.31,41.15 v33.07,41.91
SPI_SCLK
  Top 0.152: U2.P$34 24.54,33.07 25.6,33.07 27.28,34.75 33.22,34.75 36.12,37.64 36.12,40.39 35.81,40.69 35.81,41 35.36,41.45 34.9,41.45 J1.5
TX_SW  (via drill 0.35)
  Top 0.152: v20.12,37.03 20.12,24.84 U2.P$26
  Bottom 0.152: v20.12,37.03 25.91,42.82 34.9,42.82 39.32,47.24 48.77,47.24 49.99,48.46 58.52,48.46 58.83,48.16 64.47,48.16 69.95,53.65 74.98,53.65 75.74,52.88 75.74,52.12 73.3,49.68 67.82,49.68 65.84,47.7 65.84,31.55 87.94,9.45 87.94,3.2 87.17,2.44 85.5,2.44 82.6,5.33 73,5.33 70.71,3.05 70.71,2.13 70.1,1.52 63.7,1.52 62.18,3.05 SV1.3
USBD+
  Top 0.152: R7.1 11.89,4.72 9.6,4.72 8.08,6.25 X2.3
USBD-
  Top 0.152: R6.1 11.89,6.86 10.21,6.86 8.23,8.84 7.16,8.84 5.79,7.47 5.79,6.55 6.71,5.64 X2.4
VBAT  (via drill 0.35)
  Top 0.152: U9.P$3 54.86,9.45 54.56,9.45 U9.P$2 54.41,9.3 54.41,8.53 53.95,8.08 | v50.75,4.88 53.95,8.08 | 83.21,24.38 83.52,24.69 R36.2 83.21,24.38 | 83.21,24.38 82.6,23.77 82.6,21.95 83.36,21.18 83.36,20.42 R34.2 | 73.91,12.5 74.52,13.11 75.29,13.11 75.89,12.5 U8.3 | v66.6,14.48 63.55,17.53 63.55,21.03 62.79,21.79 62.79,22.71 C21.1 | 73.91,12.5 v73.15,13.26 | 73.91,12.5 U8.1 74.07,12.34 74.07,10.52 74.52,10.06 C16.1 74.68,9.91 74.68,9.45 77.11,7.01 77.11,2.44 77.42,2.13 | 83.21,24.38 88.85,18.75 88.85,4.12 86.11,1.37 78.18,1.37 77.42,2.13 | v55.32,6.71 53.95,8.08 | v60.2,6.71 68.58,6.71 72.39,2.9 72.39,2.13 73.15,1.37 76.66,1.37 77.42,2.13
  Bottom 0.152: v50.75,4.88 34.14,4.88 32.77,3.5 28.8,3.5 27.28,5.03 26.67,5.03 24.84,3.2 24.84,2.59 S3.3 | v66.6,14.48 71.93,14.48 v73.15,13.26 | v60.2,6.71 v55.32,6.71
VDD  (via drill 0.35)
  Top 0.152: R12.1 42.37,44.35 42.37,46.48 R17.1 42.22,46.63 v39.78,49.07 | 6.86,46.33 6.55,46.63 5.03,46.63 3.96,45.57 3.35,45.57 R3.2 | 6.86,46.33 6.86,45.26 6.71,45.11 5.03,45.11 3.2,43.28 3.2,41 2.44,40.23 2.44,37.49 2.59,37.34 2.59,36.73 2.44,36.58 2.44,33.38 4.88,30.94 4.88,29.57 5.49,28.96 | 5.49,28.96 5.79,28.96 U2.P$14 5.49,28.96 | 35.51,53.34 13.87,53.34 6.86,46.33 | 5.49,28.96 2.44,25.91 2.44,23.47 C2.1 | 35.51,53.34 v36.73,52.12 | 35.51,53.34 R22.2
  Bottom 0.152: v36.73,52.12 v39.78,49.07
(copper drawn outside any net)
  shapes: Top area x2